# Altium project Project-C-V4.PrjPCB (part 2 of 3)

## Sheet VoltageAmplifier.SchDoc
size B
Used 160 times, as channels U_TOP_VOLTAGE/VOLT1, U_TOP_VOLTAGE/VOLT2, U_TOP_VOLTAGE/VOLT3, U_TOP_VOLTAGE/VOLT4, U_TOP_VOLTAGE/VOLT5, U_TOP_VOLTAGE/VOLT6, U_TOP_VOLTAGE/VOLT7, U_TOP_VOLTAGE/VOLT8, U_TOP_VOLTAGE/VOLT9, U_TOP_VOLTAGE/VOLT10, U_TOP_VOLTAGE/VOLT11, U_TOP_VOLTAGE/VOLT12, U_TOP_VOLTAGE/VOLT13, U_TOP_VOLTAGE/VOLT14, U_TOP_VOLTAGE/VOLT15, U_TOP_VOLTAGE/VOLT16, U_TOP_VOLTAGE/VOLT17, U_TOP_VOLTAGE/VOLT18, U_TOP_VOLTAGE/VOLT19, U_TOP_VOLTAGE/VOLT20, U_TOP_VOLTAGE/VOLT21, U_TOP_VOLTAGE/VOLT22, U_TOP_VOLTAGE/VOLT23, U_TOP_VOLTAGE/VOLT24, U_TOP_VOLTAGE/VOLT25, U_TOP_VOLTAGE/VOLT26, U_TOP_VOLTAGE/VOLT27, U_TOP_VOLTAGE/VOLT28, U_TOP_VOLTAGE/VOLT29, U_TOP_VOLTAGE/VOLT30, U_TOP_VOLTAGE/VOLT31, U_TOP_VOLTAGE/VOLT32, U_TOP_VOLTAGE/VOLT33, U_TOP_VOLTAGE/VOLT34, U_TOP_VOLTAGE/VOLT35, U_TOP_VOLTAGE/VOLT36, U_TOP_VOLTAGE/VOLT37, U_TOP_VOLTAGE/VOLT38, U_TOP_VOLTAGE/VOLT39, U_TOP_VOLTAGE/VOLT40, U_TOP_VOLTAGE/VOLT41, U_TOP_VOLTAGE/VOLT42, U_TOP_VOLTAGE/VOLT43, U_TOP_VOLTAGE/VOLT44, U_TOP_VOLTAGE/VOLT45, U_TOP_VOLTAGE/VOLT46, U_TOP_VOLTAGE/VOLT47, U_TOP_VOLTAGE/VOLT48, U_TOP_VOLTAGE/VOLT49, U_TOP_VOLTAGE/VOLT50, U_TOP_VOLTAGE/VOLT51, U_TOP_VOLTAGE/VOLT52, U_TOP_VOLTAGE/VOLT53, U_TOP_VOLTAGE/VOLT54, U_TOP_VOLTAGE/VOLT55, U_TOP_VOLTAGE/VOLT56, U_TOP_VOLTAGE/VOLT57, U_TOP_VOLTAGE/VOLT58, U_TOP_VOLTAGE/VOLT59, U_TOP_VOLTAGE/VOLT60, U_TOP_VOLTAGE/VOLT61, U_TOP_VOLTAGE/VOLT62, U_TOP_VOLTAGE/VOLT63, U_TOP_VOLTAGE/VOLT64, U_TOP_VOLTAGE/VOLT65, U_TOP_VOLTAGE/VOLT66, U_TOP_VOLTAGE/VOLT67, U_TOP_VOLTAGE/VOLT68, U_TOP_VOLTAGE/VOLT69, U_TOP_VOLTAGE/VOLT70, U_TOP_VOLTAGE/VOLT71, U_TOP_VOLTAGE/VOLT72, U_TOP_VOLTAGE/VOLT73, U_TOP_VOLTAGE/VOLT74, U_TOP_VOLTAGE/VOLT75, U_TOP_VOLTAGE/VOLT76, U_TOP_VOLTAGE/VOLT77, U_TOP_VOLTAGE/VOLT78, U_TOP_VOLTAGE/VOLT79, U_TOP_VOLTAGE/VOLT80, U_TOP_VOLTAGE/VOLT81, U_TOP_VOLTAGE/VOLT82, U_TOP_VOLTAGE/VOLT83, U_TOP_VOLTAGE/VOLT84, U_TOP_VOLTAGE/VOLT85, U_TOP_VOLTAGE/VOLT86, U_TOP_VOLTAGE/VOLT87, U_TOP_VOLTAGE/VOLT88, U_TOP_VOLTAGE/VOLT89, U_TOP_VOLTAGE/VOLT90, U_TOP_VOLTAGE/VOLT91, U_TOP_VOLTAGE/VOLT92, U_TOP_VOLTAGE/VOLT93, U_TOP_VOLTAGE/VOLT94, U_TOP_VOLTAGE/VOLT95, U_TOP_VOLTAGE/VOLT96, U_TOP_VOLTAGE/VOLT97, U_TOP_VOLTAGE/VOLT98, U_TOP_VOLTAGE/VOLT99, U_TOP_VOLTAGE/VOLT100, U_TOP_VOLTAGE/VOLT101, U_TOP_VOLTAGE/VOLT102, U_TOP_VOLTAGE/VOLT103, U_TOP_VOLTAGE/VOLT104, U_TOP_VOLTAGE/VOLT105, U_TOP_VOLTAGE/VOLT106, U_TOP_VOLTAGE/VOLT107, U_TOP_VOLTAGE/VOLT108, U_TOP_VOLTAGE/VOLT109, U_TOP_VOLTAGE/VOLT110, U_TOP_VOLTAGE/VOLT111, U_TOP_VOLTAGE/VOLT112, U_TOP_VOLTAGE/VOLT113, U_TOP_VOLTAGE/VOLT114, U_TOP_VOLTAGE/VOLT115, U_TOP_VOLTAGE/VOLT116, U_TOP_VOLTAGE/VOLT117, U_TOP_VOLTAGE/VOLT118, U_TOP_VOLTAGE/VOLT119, U_TOP_VOLTAGE/VOLT120, U_TOP_VOLTAGE/VOLT121, U_TOP_VOLTAGE/VOLT122, U_TOP_VOLTAGE/VOLT123, U_TOP_VOLTAGE/VOLT124, U_TOP_VOLTAGE/VOLT125, U_TOP_VOLTAGE/VOLT126, U_TOP_VOLTAGE/VOLT127, U_TOP_VOLTAGE/VOLT128, U_TOP_VOLTAGE/VOLT129, U_TOP_VOLTAGE/VOLT130, U_TOP_VOLTAGE/VOLT131, U_TOP_VOLTAGE/VOLT132, U_TOP_VOLTAGE/VOLT133, U_TOP_VOLTAGE/VOLT134, U_TOP_VOLTAGE/VOLT135, U_TOP_VOLTAGE/VOLT136, U_TOP_VOLTAGE/VOLT137, U_TOP_VOLTAGE/VOLT138, U_TOP_VOLTAGE/VOLT139, U_TOP_VOLTAGE/VOLT140, U_TOP_VOLTAGE/VOLT141, U_TOP_VOLTAGE/VOLT142, U_TOP_VOLTAGE/VOLT143, U_TOP_VOLTAGE/VOLT144, U_TOP_VOLTAGE/VOLT145, U_TOP_VOLTAGE/VOLT146, U_TOP_VOLTAGE/VOLT147, U_TOP_VOLTAGE/VOLT148, U_TOP_VOLTAGE/VOLT149, U_TOP_VOLTAGE/VOLT150, U_TOP_VOLTAGE/VOLT151, U_TOP_VOLTAGE/VOLT152, U_TOP_VOLTAGE/VOLT153, U_TOP_VOLTAGE/VOLT154, U_TOP_VOLTAGE/VOLT155, U_TOP_VOLTAGE/VOLT156, U_TOP_VOLTAGE/VOLT157, U_TOP_VOLTAGE/VOLT158, U_TOP_VOLTAGE/VOLT159, U_TOP_VOLTAGE/VOLT160. Parts and nets are listed once, with the designators drawn on the sheet.
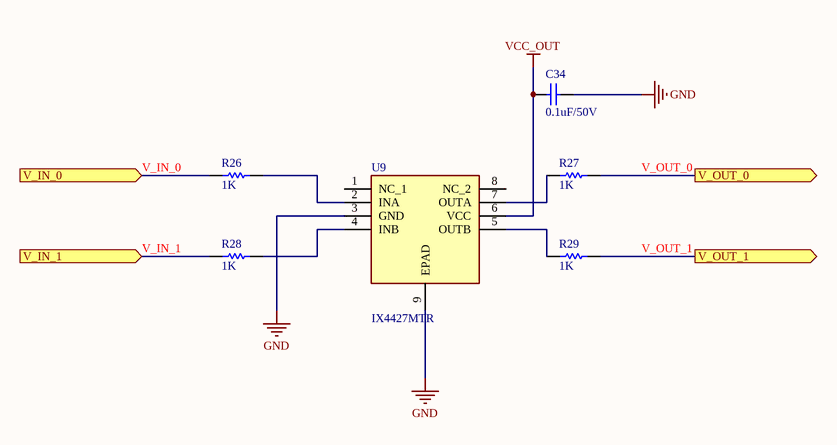
[diagram p5: VoltageAmplifier.SchDoc]

### Parts
C34  0.1uF/50V  [RAD-0.3]
R26  1K  [AXIAL-0.3]
R27  1K  [AXIAL-0.3]
R28  1K  [AXIAL-0.3]
R29  1K  [AXIAL-0.3]
U9  IX4427MTR  [SON65P300X300X90-9N]

### Ports
V_IN_0 (in), V_IN_1 (in), V_OUT_0 (out), V_OUT_1 (out)

### Nets
GND: C34.2 U9.3(GND) U9.9(EPAD)
VCC_OUT: C34.1 U9.6(VCC)
V_IN_0: R26.1 ; port V_IN_0
V_IN_1: R28.1 ; port V_IN_1
V_OUT_0: R27.2 ; port V_OUT_0
V_OUT_1: R29.2 ; port V_OUT_1
NetR26_2: R26.2 U9.2(INA)
NetR27_1: R27.1 U9.7(OUTA)
NetR28_2: R28.2 U9.4(INB)
NetR29_1: R29.1 U9.5(OUTB)

Not connected (* = marked no-connect by the designer): U9 1(NC_1) 8(NC_2)

### Channels
U_TOP_VOLTAGE/VOLT1: designators end in _VOLT1; ports V_IN_0=V_IN_0_VOLT1 V_IN_1=V_IN_1_VOLT1 V_OUT_0=V_OUT_0_VOLT1 V_OUT_1=V_OUT_1_VOLT1
U_TOP_VOLTAGE/VOLT2: designators end in _VOLT2; ports V_IN_0=V_IN_0_VOLT2 V_IN_1=V_IN_1_VOLT2 V_OUT_0=V_OUT_0_VOLT2 V_OUT_1=V_OUT_1_VOLT2
U_TOP_VOLTAGE/VOLT3: designators end in _VOLT3; ports V_IN_0=V_IN_0_VOLT3 V_IN_1=V_IN_1_VOLT3 V_OUT_0=V_OUT_0_VOLT3 V_OUT_1=V_OUT_1_VOLT3
U_TOP_VOLTAGE/VOLT4: designators end in _VOLT4; ports V_IN_0=V_IN_0_VOLT4 V_IN_1=V_IN_1_VOLT4 V_OUT_0=V_OUT_0_VOLT4 V_OUT_1=V_OUT_1_VOLT4
U_TOP_VOLTAGE/VOLT5: designators end in _VOLT5; ports V_IN_0=V_IN_0_VOLT5 V_IN_1=V_IN_1_VOLT5 V_OUT_0=V_OUT_0_VOLT5 V_OUT_1=V_OUT_1_VOLT5
U_TOP_VOLTAGE/VOLT6: designators end in _VOLT6; ports V_IN_0=V_IN_0_VOLT6 V_IN_1=V_IN_1_VOLT6 V_OUT_0=V_OUT_0_VOLT6 V_OUT_1=V_OUT_1_VOLT6
U_TOP_VOLTAGE/VOLT7: designators end in _VOLT7; ports V_IN_0=V_IN_0_VOLT7 V_IN_1=V_IN_1_VOLT7 V_OUT_0=V_OUT_0_VOLT7 V_OUT_1=V_OUT_1_VOLT7
U_TOP_VOLTAGE/VOLT8: designators end in _VOLT8; ports V_IN_0=V_IN_0_VOLT8 V_IN_1=V_IN_1_VOLT8 V_OUT_0=V_OUT_0_VOLT8 V_OUT_1=V_OUT_1_VOLT8
U_TOP_VOLTAGE/VOLT9: designators end in _VOLT9; ports V_IN_0=V_IN_0_VOLT9 V_IN_1=V_IN_1_VOLT9 V_OUT_0=V_OUT_0_VOLT9 V_OUT_1=V_OUT_1_VOLT9
U_TOP_VOLTAGE/VOLT10: designators end in _VOLT10; ports V_IN_0=V_IN_0_VOLT10 V_IN_1=V_IN_1_VOLT10 V_OUT_0=V_OUT_0_VOLT10 V_OUT_1=V_OUT_1_VOLT10
U_TOP_VOLTAGE/VOLT11: designators end in _VOLT11; ports V_IN_0=V_IN_0_VOLT11 V_IN_1=V_IN_1_VOLT11 V_OUT_0=V_OUT_0_VOLT11 V_OUT_1=V_OUT_1_VOLT11
U_TOP_VOLTAGE/VOLT12: designators end in _VOLT12; ports V_IN_0=V_IN_0_VOLT12 V_IN_1=V_IN_1_VOLT12 V_OUT_0=V_OUT_0_VOLT12 V_OUT_1=V_OUT_1_VOLT12
U_TOP_VOLTAGE/VOLT13: designators end in _VOLT13; ports V_IN_0=V_IN_0_VOLT13 V_IN_1=V_IN_1_VOLT13 V_OUT_0=V_OUT_0_VOLT13 V_OUT_1=V_OUT_1_VOLT13
U_TOP_VOLTAGE/VOLT14: designators end in _VOLT14; ports V_IN_0=V_IN_0_VOLT14 V_IN_1=V_IN_1_VOLT14 V_OUT_0=V_OUT_0_VOLT14 V_OUT_1=V_OUT_1_VOLT14
U_TOP_VOLTAGE/VOLT15: designators end in _VOLT15; ports V_IN_0=V_IN_0_VOLT15 V_IN_1=V_IN_1_VOLT15 V_OUT_0=V_OUT_0_VOLT15 V_OUT_1=V_OUT_1_VOLT15
U_TOP_VOLTAGE/VOLT16: designators end in _VOLT16; ports V_IN_0=V_IN_0_VOLT16 V_IN_1=V_IN_1_VOLT16 V_OUT_0=V_OUT_0_VOLT16 V_OUT_1=V_OUT_1_VOLT16
U_TOP_VOLTAGE/VOLT17: designators end in _VOLT17; ports V_IN_0=V_IN_0_VOLT17 V_IN_1=V_IN_1_VOLT17 V_OUT_0=V_OUT_0_VOLT17 V_OUT_1=V_OUT_1_VOLT17
U_TOP_VOLTAGE/VOLT18: designators end in _VOLT18; ports V_IN_0=V_IN_0_VOLT18 V_IN_1=V_IN_1_VOLT18 V_OUT_0=V_OUT_0_VOLT18 V_OUT_1=V_OUT_1_VOLT18
U_TOP_VOLTAGE/VOLT19: designators end in _VOLT19; ports V_IN_0=V_IN_0_VOLT19 V_IN_1=V_IN_1_VOLT19 V_OUT_0=V_OUT_0_VOLT19 V_OUT_1=V_OUT_1_VOLT19
U_TOP_VOLTAGE/VOLT20: designators end in _VOLT20; ports V_IN_0=V_IN_0_VOLT20 V_IN_1=V_IN_1_VOLT20 V_OUT_0=V_OUT_0_VOLT20 V_OUT_1=V_OUT_1_VOLT20
U_TOP_VOLTAGE/VOLT21: designators end in _VOLT21; ports V_IN_0=V_IN_0_VOLT21 V_IN_1=V_IN_1_VOLT21 V_OUT_0=V_OUT_0_VOLT21 V_OUT_1=V_OUT_1_VOLT21
U_TOP_VOLTAGE/VOLT22: designators end in _VOLT22; ports V_IN_0=V_IN_0_VOLT22 V_IN_1=V_IN_1_VOLT22 V_OUT_0=V_OUT_0_VOLT22 V_OUT_1=V_OUT_1_VOLT22
U_TOP_VOLTAGE/VOLT23: designators end in _VOLT23; ports V_IN_0=V_IN_0_VOLT23 V_IN_1=V_IN_1_VOLT23 V_OUT_0=V_OUT_0_VOLT23 V_OUT_1=V_OUT_1_VOLT23
U_TOP_VOLTAGE/VOLT24: designators end in _VOLT24; ports V_IN_0=V_IN_0_VOLT24 V_IN_1=V_IN_1_VOLT24 V_OUT_0=V_OUT_0_VOLT24 V_OUT_1=V_OUT_1_VOLT24
U_TOP_VOLTAGE/VOLT25: designators end in _VOLT25; ports V_IN_0=V_IN_0_VOLT25 V_IN_1=V_IN_1_VOLT25 V_OUT_0=V_OUT_0_VOLT25 V_OUT_1=V_OUT_1_VOLT25
U_TOP_VOLTAGE/VOLT26: designators end in _VOLT26; ports V_IN_0=V_IN_0_VOLT26 V_IN_1=V_IN_1_VOLT26 V_OUT_0=V_OUT_0_VOLT26 V_OUT_1=V_OUT_1_VOLT26
U_TOP_VOLTAGE/VOLT27: designators end in _VOLT27; ports V_IN_0=V_IN_0_VOLT27 V_IN_1=V_IN_1_VOLT27 V_OUT_0=V_OUT_0_VOLT27 V_OUT_1=V_OUT_1_VOLT27
U_TOP_VOLTAGE/VOLT28: designators end in _VOLT28; ports V_IN_0=V_IN_0_VOLT28 V_IN_1=V_IN_1_VOLT28 V_OUT_0=V_OUT_0_VOLT28 V_OUT_1=V_OUT_1_VOLT28
U_TOP_VOLTAGE/VOLT29: designators end in _VOLT29; ports V_IN_0=V_IN_0_VOLT29 V_IN_1=V_IN_1_VOLT29 V_OUT_0=V_OUT_0_VOLT29 V_OUT_1=V_OUT_1_VOLT29
U_TOP_VOLTAGE/VOLT30: designators end in _VOLT30; ports V_IN_0=V_IN_0_VOLT30 V_IN_1=V_IN_1_VOLT30 V_OUT_0=V_OUT_0_VOLT30 V_OUT_1=V_OUT_1_VOLT30
U_TOP_VOLTAGE/VOLT31: designators end in _VOLT31; ports V_IN_0=V_IN_0_VOLT31 V_IN_1=V_IN_1_VOLT31 V_OUT_0=V_OUT_0_VOLT31 V_OUT_1=V_OUT_1_VOLT31
U_TOP_VOLTAGE/VOLT32: designators end in _VOLT32; ports V_IN_0=V_IN_0_VOLT32 V_IN_1=V_IN_1_VOLT32 V_OUT_0=V_OUT_0_VOLT32 V_OUT_1=V_OUT_1_VOLT32
U_TOP_VOLTAGE/VOLT33: designators end in _VOLT33; ports V_IN_0=V_IN_0_VOLT33 V_IN_1=V_IN_1_VOLT33 V_OUT_0=V_OUT_0_VOLT33 V_OUT_1=V_OUT_1_VOLT33
U_TOP_VOLTAGE/VOLT34: designators end in _VOLT34; ports V_IN_0=V_IN_0_VOLT34 V_IN_1=V_IN_1_VOLT34 V_OUT_0=V_OUT_0_VOLT34 V_OUT_1=V_OUT_1_VOLT34
U_TOP_VOLTAGE/VOLT35: designators end in _VOLT35; ports V_IN_0=V_IN_0_VOLT35 V_IN_1=V_IN_1_VOLT35 V_OUT_0=V_OUT_0_VOLT35 V_OUT_1=V_OUT_1_VOLT35
U_TOP_VOLTAGE/VOLT36: designators end in _VOLT36; ports V_IN_0=V_IN_0_VOLT36 V_IN_1=V_IN_1_VOLT36 V_OUT_0=V_OUT_0_VOLT36 V_OUT_1=V_OUT_1_VOLT36
U_TOP_VOLTAGE/VOLT37: designators end in _VOLT37; ports V_IN_0=V_IN_0_VOLT37 V_IN_1=V_IN_1_VOLT37 V_OUT_0=V_OUT_0_VOLT37 V_OUT_1=V_OUT_1_VOLT37
U_TOP_VOLTAGE/VOLT38: designators end in _VOLT38; ports V_IN_0=V_IN_0_VOLT38 V_IN_1=V_IN_1_VOLT38 V_OUT_0=V_OUT_0_VOLT38 V_OUT_1=V_OUT_1_VOLT38
U_TOP_VOLTAGE/VOLT39: designators end in _VOLT39; ports V_IN_0=V_IN_0_VOLT39 V_IN_1=V_IN_1_VOLT39 V_OUT_0=V_OUT_0_VOLT39 V_OUT_1=V_OUT_1_VOLT39
U_TOP_VOLTAGE/VOLT40: designators end in _VOLT40; ports V_IN_0=V_IN_0_VOLT40 V_IN_1=V_IN_1_VOLT40 V_OUT_0=V_OUT_0_VOLT40 V_OUT_1=V_OUT_1_VOLT40
U_TOP_VOLTAGE/VOLT41: designators end in _VOLT41; ports V_IN_0=V_IN_0_VOLT41 V_IN_1=V_IN_1_VOLT41 V_OUT_0=V_OUT_0_VOLT41 V_OUT_1=V_OUT_1_VOLT41
U_TOP_VOLTAGE/VOLT42: designators end in _VOLT42; ports V_IN_0=V_IN_0_VOLT42 V_IN_1=V_IN_1_VOLT42 V_OUT_0=V_OUT_0_VOLT42 V_OUT_1=V_OUT_1_VOLT42
U_TOP_VOLTAGE/VOLT43: designators end in _VOLT43; ports V_IN_0=V_IN_0_VOLT43 V_IN_1=V_IN_1_VOLT43 V_OUT_0=V_OUT_0_VOLT43 V_OUT_1=V_OUT_1_VOLT43
U_TOP_VOLTAGE/VOLT44: designators end in _VOLT44; ports V_IN_0=V_IN_0_VOLT44 V_IN_1=V_IN_1_VOLT44 V_OUT_0=V_OUT_0_VOLT44 V_OUT_1=V_OUT_1_VOLT44
U_TOP_VOLTAGE/VOLT45: designators end in _VOLT45; ports V_IN_0=V_IN_0_VOLT45 V_IN_1=V_IN_1_VOLT45 V_OUT_0=V_OUT_0_VOLT45 V_OUT_1=V_OUT_1_VOLT45
U_TOP_VOLTAGE/VOLT46: designators end in _VOLT46; ports V_IN_0=V_IN_0_VOLT46 V_IN_1=V_IN_1_VOLT46 V_OUT_0=V_OUT_0_VOLT46 V_OUT_1=V_OUT_1_VOLT46
U_TOP_VOLTAGE/VOLT47: designators end in _VOLT47; ports V_IN_0=V_IN_0_VOLT47 V_IN_1=V_IN_1_VOLT47 V_OUT_0=V_OUT_0_VOLT47 V_OUT_1=V_OUT_1_VOLT47
U_TOP_VOLTAGE/VOLT48: designators end in _VOLT48; ports V_IN_0=V_IN_0_VOLT48 V_IN_1=V_IN_1_VOLT48 V_OUT_0=V_OUT_0_VOLT48 V_OUT_1=V_OUT_1_VOLT48
U_TOP_VOLTAGE/VOLT49: designators end in _VOLT49; ports V_IN_0=V_IN_0_VOLT49 V_IN_1=V_IN_1_VOLT49 V_OUT_0=V_OUT_0_VOLT49 V_OUT_1=V_OUT_1_VOLT49
U_TOP_VOLTAGE/VOLT50: designators end in _VOLT50; ports V_IN_0=V_IN_0_VOLT50 V_IN_1=V_IN_1_VOLT50 V_OUT_0=V_OUT_0_VOLT50 V_OUT_1=V_OUT_1_VOLT50
U_TOP_VOLTAGE/VOLT51: designators end in _VOLT51; ports V_IN_0=V_IN_0_VOLT51 V_IN_1=V_IN_1_VOLT51 V_OUT_0=V_OUT_0_VOLT51 V_OUT_1=V_OUT_1_VOLT51
U_TOP_VOLTAGE/VOLT52: designators end in _VOLT52; ports V_IN_0=V_IN_0_VOLT52 V_IN_1=V_IN_1_VOLT52 V_OUT_0=V_OUT_0_VOLT52 V_OUT_1=V_OUT_1_VOLT52
U_TOP_VOLTAGE/VOLT53: designators end in _VOLT53; ports V_IN_0=V_IN_0_VOLT53 V_IN_1=V_IN_1_VOLT53 V_OUT_0=V_OUT_0_VOLT53 V_OUT_1=V_OUT_1_VOLT53
U_TOP_VOLTAGE/VOLT54: designators end in _VOLT54; ports V_IN_0=V_IN_0_VOLT54 V_IN_1=V_IN_1_VOLT54 V_OUT_0=V_OUT_0_VOLT54 V_OUT_1=V_OUT_1_VOLT54
U_TOP_VOLTAGE/VOLT55: designators end in _VOLT55; ports V_IN_0=V_IN_0_VOLT55 V_IN_1=V_IN_1_VOLT55 V_OUT_0=V_OUT_0_VOLT55 V_OUT_1=V_OUT_1_VOLT55
U_TOP_VOLTAGE/VOLT56: designators end in _VOLT56; ports V_IN_0=V_IN_0_VOLT56 V_IN_1=V_IN_1_VOLT56 V_OUT_0=V_OUT_0_VOLT56 V_OUT_1=V_OUT_1_VOLT56
U_TOP_VOLTAGE/VOLT57: designators end in _VOLT57; ports V_IN_0=V_IN_0_VOLT57 V_IN_1=V_IN_1_VOLT57 V_OUT_0=V_OUT_0_VOLT57 V_OUT_1=V_OUT_1_VOLT57
U_TOP_VOLTAGE/VOLT58: designators end in _VOLT58; ports V_IN_0=V_IN_0_VOLT58 V_IN_1=V_IN_1_VOLT58 V_OUT_0=V_OUT_0_VOLT58 V_OUT_1=V_OUT_1_VOLT58
U_TOP_VOLTAGE/VOLT59: designators end in _VOLT59; ports V_IN_0=V_IN_0_VOLT59 V_IN_1=V_IN_1_VOLT59 V_OUT_0=V_OUT_0_VOLT59 V_OUT_1=V_OUT_1_VOLT59
U_TOP_VOLTAGE/VOLT60: designators end in _VOLT60; ports V_IN_0=V_IN_0_VOLT60 V_IN_1=V_IN_1_VOLT60 V_OUT_0=V_OUT_0_VOLT60 V_OUT_1=V_OUT_1_VOLT60
U_TOP_VOLTAGE/VOLT61: designators end in _VOLT61; ports V_IN_0=V_IN_0_VOLT61 V_IN_1=V_IN_1_VOLT61 V_OUT_0=V_OUT_0_VOLT61 V_OUT_1=V_OUT_1_VOLT61
U_TOP_VOLTAGE/VOLT62: designators end in _VOLT62; ports V_IN_0=V_IN_0_VOLT62 V_IN_1=V_IN_1_VOLT62 V_OUT_0=V_OUT_0_VOLT62 V_OUT_1=V_OUT_1_VOLT62
U_TOP_VOLTAGE/VOLT63: designators end in _VOLT63; ports V_IN_0=V_IN_0_VOLT63 V_IN_1=V_IN_1_VOLT63 V_OUT_0=V_OUT_0_VOLT63 V_OUT_1=V_OUT_1_VOLT63
U_TOP_VOLTAGE/VOLT64: designators end in _VOLT64; ports V_IN_0=V_IN_0_VOLT64 V_IN_1=V_IN_1_VOLT64 V_OUT_0=V_OUT_0_VOLT64 V_OUT_1=V_OUT_1_VOLT64
U_TOP_VOLTAGE/VOLT65: designators end in _VOLT65; ports V_IN_0=V_IN_0_VOLT65 V_IN_1=V_IN_1_VOLT65 V_OUT_0=V_OUT_0_VOLT65 V_OUT_1=V_OUT_1_VOLT65
U_TOP_VOLTAGE/VOLT66: designators end in _VOLT66; ports V_IN_0=V_IN_0_VOLT66 V_IN_1=V_IN_1_VOLT66 V_OUT_0=V_OUT_0_VOLT66 V_OUT_1=V_OUT_1_VOLT66
U_TOP_VOLTAGE/VOLT67: designators end in _VOLT67; ports V_IN_0=V_IN_0_VOLT67 V_IN_1=V_IN_1_VOLT67 V_OUT_0=V_OUT_0_VOLT67 V_OUT_1=V_OUT_1_VOLT67
U_TOP_VOLTAGE/VOLT68: designators end in _VOLT68; ports V_IN_0=V_IN_0_VOLT68 V_IN_1=V_IN_1_VOLT68 V_OUT_0=V_OUT_0_VOLT68 V_OUT_1=V_OUT_1_VOLT68
U_TOP_VOLTAGE/VOLT69: designators end in _VOLT69; ports V_IN_0=V_IN_0_VOLT69 V_IN_1=V_IN_1_VOLT69 V_OUT_0=V_OUT_0_VOLT69 V_OUT_1=V_OUT_1_VOLT69
U_TOP_VOLTAGE/VOLT70: designators end in _VOLT70; ports V_IN_0=V_IN_0_VOLT70 V_IN_1=V_IN_1_VOLT70 V_OUT_0=V_OUT_0_VOLT70 V_OUT_1=V_OUT_1_VOLT70
U_TOP_VOLTAGE/VOLT71: designators end in _VOLT71; ports V_IN_0=V_IN_0_VOLT71 V_IN_1=V_IN_1_VOLT71 V_OUT_0=V_OUT_0_VOLT71 V_OUT_1=V_OUT_1_VOLT71
U_TOP_VOLTAGE/VOLT72: designators end in _VOLT72; ports V_IN_0=V_IN_0_VOLT72 V_IN_1=V_IN_1_VOLT72 V_OUT_0=V_OUT_0_VOLT72 V_OUT_1=V_OUT_1_VOLT72
U_TOP_VOLTAGE/VOLT73: designators end in _VOLT73; ports V_IN_0=V_IN_0_VOLT73 V_IN_1=V_IN_1_VOLT73 V_OUT_0=V_OUT_0_VOLT73 V_OUT_1=V_OUT_1_VOLT73
U_TOP_VOLTAGE/VOLT74: designators end in _VOLT74; ports V_IN_0=V_IN_0_VOLT74 V_IN_1=V_IN_1_VOLT74 V_OUT_0=V_OUT_0_VOLT74 V_OUT_1=V_OUT_1_VOLT74
U_TOP_VOLTAGE/VOLT75: designators end in _VOLT75; ports V_IN_0=V_IN_0_VOLT75 V_IN_1=V_IN_1_VOLT75 V_OUT_0=V_OUT_0_VOLT75 V_OUT_1=V_OUT_1_VOLT75
U_TOP_VOLTAGE/VOLT76: designators end in _VOLT76; ports V_IN_0=V_IN_0_VOLT76 V_IN_1=V_IN_1_VOLT76 V_OUT_0=V_OUT_0_VOLT76 V_OUT_1=V_OUT_1_VOLT76
U_TOP_VOLTAGE/VOLT77: designators end in _VOLT77; ports V_IN_0=V_IN_0_VOLT77 V_IN_1=V_IN_1_VOLT77 V_OUT_0=V_OUT_0_VOLT77 V_OUT_1=V_OUT_1_VOLT77
U_TOP_VOLTAGE/VOLT78: designators end in _VOLT78; ports V_IN_0=V_IN_0_VOLT78 V_IN_1=V_IN_1_VOLT78 V_OUT_0=V_OUT_0_VOLT78 V_OUT_1=V_OUT_1_VOLT78
U_TOP_VOLTAGE/VOLT79: designators end in _VOLT79; ports V_IN_0=V_IN_0_VOLT79 V_IN_1=V_IN_1_VOLT79 V_OUT_0=V_OUT_0_VOLT79 V_OUT_1=V_OUT_1_VOLT79
U_TOP_VOLTAGE/VOLT80: designators end in _VOLT80; ports V_IN_0=V_IN_0_VOLT80 V_IN_1=V_IN_1_VOLT80 V_OUT_0=V_OUT_0_VOLT80 V_OUT_1=V_OUT_1_VOLT80
U_TOP_VOLTAGE/VOLT81: designators end in _VOLT81; ports V_IN_0=V_IN_0_VOLT81 V_IN_1=V_IN_1_VOLT81 V_OUT_0=V_OUT_0_VOLT81 V_OUT_1=V_OUT_1_VOLT81
U_TOP_VOLTAGE/VOLT82: designators end in _VOLT82; ports V_IN_0=V_IN_0_VOLT82 V_IN_1=V_IN_1_VOLT82 V_OUT_0=V_OUT_0_VOLT82 V_OUT_1=V_OUT_1_VOLT82
U_TOP_VOLTAGE/VOLT83: designators end in _VOLT83; ports V_IN_0=V_IN_0_VOLT83 V_IN_1=V_IN_1_VOLT83 V_OUT_0=V_OUT_0_VOLT83 V_OUT_1=V_OUT_1_VOLT83
U_TOP_VOLTAGE/VOLT84: designators end in _VOLT84; ports V_IN_0=V_IN_0_VOLT84 V_IN_1=V_IN_1_VOLT84 V_OUT_0=V_OUT_0_VOLT84 V_OUT_1=V_OUT_1_VOLT84
U_TOP_VOLTAGE/VOLT85: designators end in _VOLT85; ports V_IN_0=V_IN_0_VOLT85 V_IN_1=V_IN_1_VOLT85 V_OUT_0=V_OUT_0_VOLT85 V_OUT_1=V_OUT_1_VOLT85
U_TOP_VOLTAGE/VOLT86: designators end in _VOLT86; ports V_IN_0=V_IN_0_VOLT86 V_IN_1=V_IN_1_VOLT86 V_OUT_0=V_OUT_0_VOLT86 V_OUT_1=V_OUT_1_VOLT86
U_TOP_VOLTAGE/VOLT87: designators end in _VOLT87; ports V_IN_0=V_IN_0_VOLT87 V_IN_1=V_IN_1_VOLT87 V_OUT_0=V_OUT_0_VOLT87 V_OUT_1=V_OUT_1_VOLT87
U_TOP_VOLTAGE/VOLT88: designators end in _VOLT88; ports V_IN_0=V_IN_0_VOLT88 V_IN_1=V_IN_1_VOLT88 V_OUT_0=V_OUT_0_VOLT88 V_OUT_1=V_OUT_1_VOLT88
U_TOP_VOLTAGE/VOLT89: designators end in _VOLT89; ports V_IN_0=V_IN_0_VOLT89 V_IN_1=V_IN_1_VOLT89 V_OUT_0=V_OUT_0_VOLT89 V_OUT_1=V_OUT_1_VOLT89
U_TOP_VOLTAGE/VOLT90: designators end in _VOLT90; ports V_IN_0=V_IN_0_VOLT90 V_IN_1=V_IN_1_VOLT90 V_OUT_0=V_OUT_0_VOLT90 V_OUT_1=V_OUT_1_VOLT90
U_TOP_VOLTAGE/VOLT91: designators end in _VOLT91; ports V_IN_0=V_IN_0_VOLT91 V_IN_1=V_IN_1_VOLT91 V_OUT_0=V_OUT_0_VOLT91 V_OUT_1=V_OUT_1_VOLT91
U_TOP_VOLTAGE/VOLT92: designators end in _VOLT92; ports V_IN_0=V_IN_0_VOLT92 V_IN_1=V_IN_1_VOLT92 V_OUT_0=V_OUT_0_VOLT92 V_OUT_1=V_OUT_1_VOLT92
U_TOP_VOLTAGE/VOLT93: designators end in _VOLT93; ports V_IN_0=V_IN_0_VOLT93 V_IN_1=V_IN_1_VOLT93 V_OUT_0=V_OUT_0_VOLT93 V_OUT_1=V_OUT_1_VOLT93
U_TOP_VOLTAGE/VOLT94: designators end in _VOLT94; ports V_IN_0=V_IN_0_VOLT94 V_IN_1=V_IN_1_VOLT94 V_OUT_0=V_OUT_0_VOLT94 V_OUT_1=V_OUT_1_VOLT94
U_TOP_VOLTAGE/VOLT95: designators end in _VOLT95; ports V_IN_0=V_IN_0_VOLT95 V_IN_1=V_IN_1_VOLT95 V_OUT_0=V_OUT_0_VOLT95 V_OUT_1=V_OUT_1_VOLT95
U_TOP_VOLTAGE/VOLT96: designators end in _VOLT96; ports V_IN_0=V_IN_0_VOLT96 V_IN_1=V_IN_1_VOLT96 V_OUT_0=V_OUT_0_VOLT96 V_OUT_1=V_OUT_1_VOLT96
U_TOP_VOLTAGE/VOLT97: designators end in _VOLT97; ports V_IN_0=V_IN_0_VOLT97 V_IN_1=V_IN_1_VOLT97 V_OUT_0=V_OUT_0_VOLT97 V_OUT_1=V_OUT_1_VOLT97
U_TOP_VOLTAGE/VOLT98: designators end in _VOLT98; ports V_IN_0=V_IN_0_VOLT98 V_IN_1=V_IN_1_VOLT98 V_OUT_0=V_OUT_0_VOLT98 V_OUT_1=V_OUT_1_VOLT98
U_TOP_VOLTAGE/VOLT99: designators end in _VOLT99; ports V_IN_0=V_IN_0_VOLT99 V_IN_1=V_IN_1_VOLT99 V_OUT_0=V_OUT_0_VOLT99 V_OUT_1=V_OUT_1_VOLT99
U_TOP_VOLTAGE/VOLT100: designators end in _VOLT100; ports V_IN_0=V_IN_0_VOLT100 V_IN_1=V_IN_1_VOLT100 V_OUT_0=V_OUT_0_VOLT100 V_OUT_1=V_OUT_1_VOLT100
U_TOP_VOLTAGE/VOLT101: designators end in _VOLT101; ports V_IN_0=V_IN_0_VOLT101 V_IN_1=V_IN_1_VOLT101 V_OUT_0=V_OUT_0_VOLT101 V_OUT_1=V_OUT_1_VOLT101
U_TOP_VOLTAGE/VOLT102: designators end in _VOLT102; ports V_IN_0=V_IN_0_VOLT102 V_IN_1=V_IN_1_VOLT102 V_OUT_0=V_OUT_0_VOLT102 V_OUT_1=V_OUT_1_VOLT102
U_TOP_VOLTAGE/VOLT103: designators end in _VOLT103; ports V_IN_0=V_IN_0_VOLT103 V_IN_1=V_IN_1_VOLT103 V_OUT_0=V_OUT_0_VOLT103 V_OUT_1=V_OUT_1_VOLT103
U_TOP_VOLTAGE/VOLT104: designators end in _VOLT104; ports V_IN_0=V_IN_0_VOLT104 V_IN_1=V_IN_1_VOLT104 V_OUT_0=V_OUT_0_VOLT104 V_OUT_1=V_OUT_1_VOLT104
U_TOP_VOLTAGE/VOLT105: designators end in _VOLT105; ports V_IN_0=V_IN_0_VOLT105 V_IN_1=V_IN_1_VOLT105 V_OUT_0=V_OUT_0_VOLT105 V_OUT_1=V_OUT_1_VOLT105
U_TOP_VOLTAGE/VOLT106: designators end in _VOLT106; ports V_IN_0=V_IN_0_VOLT106 V_IN_1=V_IN_1_VOLT106 V_OUT_0=V_OUT_0_VOLT106 V_OUT_1=V_OUT_1_VOLT106
U_TOP_VOLTAGE/VOLT107: designators end in _VOLT107; ports V_IN_0=V_IN_0_VOLT107 V_IN_1=V_IN_1_VOLT107 V_OUT_0=V_OUT_0_VOLT107 V_OUT_1=V_OUT_1_VOLT107
U_TOP_VOLTAGE/VOLT108: designators end in _VOLT108; ports V_IN_0=V_IN_0_VOLT108 V_IN_1=V_IN_1_VOLT108 V_OUT_0=V_OUT_0_VOLT108 V_OUT_1=V_OUT_1_VOLT108
U_TOP_VOLTAGE/VOLT109: designators end in _VOLT109; ports V_IN_0=V_IN_0_VOLT109 V_IN_1=V_IN_1_VOLT109 V_OUT_0=V_OUT_0_VOLT109 V_OUT_1=V_OUT_1_VOLT109
U_TOP_VOLTAGE/VOLT110: designators end in _VOLT110; ports V_IN_0=V_IN_0_VOLT110 V_IN_1=V_IN_1_VOLT110 V_OUT_0=V_OUT_0_VOLT110 V_OUT_1=V_OUT_1_VOLT110
U_TOP_VOLTAGE/VOLT111: designators end in _VOLT111; ports V_IN_0=V_IN_0_VOLT111 V_IN_1=V_IN_1_VOLT111 V_OUT_0=V_OUT_0_VOLT111 V_OUT_1=V_OUT_1_VOLT111
U_TOP_VOLTAGE/VOLT112: designators end in _VOLT112; ports V_IN_0=V_IN_0_VOLT112 V_IN_1=V_IN_1_VOLT112 V_OUT_0=V_OUT_0_VOLT112 V_OUT_1=V_OUT_1_VOLT112
U_TOP_VOLTAGE/VOLT113: designators end in _VOLT113; ports V_IN_0=V_IN_0_VOLT113 V_IN_1=V_IN_1_VOLT113 V_OUT_0=V_OUT_0_VOLT113 V_OUT_1=V_OUT_1_VOLT113
U_TOP_VOLTAGE/VOLT114: designators end in _VOLT114; ports V_IN_0=V_IN_0_VOLT114 V_IN_1=V_IN_1_VOLT114 V_OUT_0=V_OUT_0_VOLT114 V_OUT_1=V_OUT_1_VOLT114
U_TOP_VOLTAGE/VOLT115: designators end in _VOLT115; ports V_IN_0=V_IN_0_VOLT115 V_IN_1=V_IN_1_VOLT115 V_OUT_0=V_OUT_0_VOLT115 V_OUT_1=V_OUT_1_VOLT115
U_TOP_VOLTAGE/VOLT116: designators end in _VOLT116; ports V_IN_0=V_IN_0_VOLT116 V_IN_1=V_IN_1_VOLT116 V_OUT_0=V_OUT_0_VOLT116 V_OUT_1=V_OUT_1_VOLT116
U_TOP_VOLTAGE/VOLT117: designators end in _VOLT117; ports V_IN_0=V_IN_0_VOLT117 V_IN_1=V_IN_1_VOLT117 V_OUT_0=V_OUT_0_VOLT117 V_OUT_1=V_OUT_1_VOLT117
U_TOP_VOLTAGE/VOLT118: designators end in _VOLT118; ports V_IN_0=V_IN_0_VOLT118 V_IN_1=V_IN_1_VOLT118 V_OUT_0=V_OUT_0_VOLT118 V_OUT_1=V_OUT_1_VOLT118
U_TOP_VOLTAGE/VOLT119: designators end in _VOLT119; ports V_IN_0=V_IN_0_VOLT119 V_IN_1=V_IN_1_VOLT119 V_OUT_0=V_OUT_0_VOLT119 V_OUT_1=V_OUT_1_VOLT119
U_TOP_VOLTAGE/VOLT120: designators end in _VOLT120; ports V_IN_0=V_IN_0_VOLT120 V_IN_1=V_IN_1_VOLT120 V_OUT_0=V_OUT_0_VOLT120 V_OUT_1=V_OUT_1_VOLT120
U_TOP_VOLTAGE/VOLT121: designators end in _VOLT121; ports V_IN_0=V_IN_0_VOLT121 V_IN_1=V_IN_1_VOLT121 V_OUT_0=V_OUT_0_VOLT121 V_OUT_1=V_OUT_1_VOLT121
U_TOP_VOLTAGE/VOLT122: designators end in _VOLT122; ports V_IN_0=V_IN_0_VOLT122 V_IN_1=V_IN_1_VOLT122 V_OUT_0=V_OUT_0_VOLT122 V_OUT_1=V_OUT_1_VOLT122
U_TOP_VOLTAGE/VOLT123: designators end in _VOLT123; ports V_IN_0=V_IN_0_VOLT123 V_IN_1=V_IN_1_VOLT123 V_OUT_0=V_OUT_0_VOLT123 V_OUT_1=V_OUT_1_VOLT123
U_TOP_VOLTAGE/VOLT124: designators end in _VOLT124; ports V_IN_0=V_IN_0_VOLT124 V_IN_1=V_IN_1_VOLT124 V_OUT_0=V_OUT_0_VOLT124 V_OUT_1=V_OUT_1_VOLT124
U_TOP_VOLTAGE/VOLT125: designators end in _VOLT125; ports V_IN_0=V_IN_0_VOLT125 V_IN_1=V_IN_1_VOLT125 V_OUT_0=V_OUT_0_VOLT125 V_OUT_1=V_OUT_1_VOLT125
U_TOP_VOLTAGE/VOLT126: designators end in _VOLT126; ports V_IN_0=V_IN_0_VOLT126 V_IN_1=V_IN_1_VOLT126 V_OUT_0=V_OUT_0_VOLT126 V_OUT_1=V_OUT_1_VOLT126
U_TOP_VOLTAGE/VOLT127: designators end in _VOLT127; ports V_IN_0=V_IN_0_VOLT127 V_IN_1=V_IN_1_VOLT127 V_OUT_0=V_OUT_0_VOLT127 V_OUT_1=V_OUT_1_VOLT127
U_TOP_VOLTAGE/VOLT128: designators end in _VOLT128; ports V_IN_0=V_IN_0_VOLT128 V_IN_1=V_IN_1_VOLT128 V_OUT_0=V_OUT_0_VOLT128 V_OUT_1=V_OUT_1_VOLT128
U_TOP_VOLTAGE/VOLT129: designators end in _VOLT129; ports V_IN_0=V_IN_0_VOLT129 V_IN_1=V_IN_1_VOLT129 V_OUT_0=V_OUT_0_VOLT129 V_OUT_1=V_OUT_1_VOLT129
U_TOP_VOLTAGE/VOLT130: designators end in _VOLT130; ports V_IN_0=V_IN_0_VOLT130 V_IN_1=V_IN_1_VOLT130 V_OUT_0=V_OUT_0_VOLT130 V_OUT_1=V_OUT_1_VOLT130
U_TOP_VOLTAGE/VOLT131: designators end in _VOLT131; ports V_IN_0=V_IN_0_VOLT131 V_IN_1=V_IN_1_VOLT131 V_OUT_0=V_OUT_0_VOLT131 V_OUT_1=V_OUT_1_VOLT131
U_TOP_VOLTAGE/VOLT132: designators end in _VOLT132; ports V_IN_0=V_IN_0_VOLT132 V_IN_1=V_IN_1_VOLT132 V_OUT_0=V_OUT_0_VOLT132 V_OUT_1=V_OUT_1_VOLT132
U_TOP_VOLTAGE/VOLT133: designators end in _VOLT133; ports V_IN_0=V_IN_0_VOLT133 V_IN_1=V_IN_1_VOLT133 V_OUT_0=V_OUT_0_VOLT133 V_OUT_1=V_OUT_1_VOLT133
U_TOP_VOLTAGE/VOLT134: designators end in _VOLT134; ports V_IN_0=V_IN_0_VOLT134 V_IN_1=V_IN_1_VOLT134 V_OUT_0=V_OUT_0_VOLT134 V_OUT_1=V_OUT_1_VOLT134
U_TOP_VOLTAGE/VOLT135: designators end in _VOLT135; ports V_IN_0=V_IN_0_VOLT135 V_IN_1=V_IN_1_VOLT135 V_OUT_0=V_OUT_0_VOLT135 V_OUT_1=V_OUT_1_VOLT135
U_TOP_VOLTAGE/VOLT136: designators end in _VOLT136; ports V_IN_0=V_IN_0_VOLT136 V_IN_1=V_IN_1_VOLT136 V_OUT_0=V_OUT_0_VOLT136 V_OUT_1=V_OUT_1_VOLT136
U_TOP_VOLTAGE/VOLT137: designators end in _VOLT137; ports V_IN_0=V_IN_0_VOLT137 V_IN_1=V_IN_1_VOLT137 V_OUT_0=V_OUT_0_VOLT137 V_OUT_1=V_OUT_1_VOLT137
U_TOP_VOLTAGE/VOLT138: designators end in _VOLT138; ports V_IN_0=V_IN_0_VOLT138 V_IN_1=V_IN_1_VOLT138 V_OUT_0=V_OUT_0_VOLT138 V_OUT_1=V_OUT_1_VOLT138
U_TOP_VOLTAGE/VOLT139: designators end in _VOLT139; ports V_IN_0=V_IN_0_VOLT139 V_IN_1=V_IN_1_VOLT139 V_OUT_0=V_OUT_0_VOLT139 V_OUT_1=V_OUT_1_VOLT139
U_TOP_VOLTAGE/VOLT140: designators end in _VOLT140; ports V_IN_0=V_IN_0_VOLT140 V_IN_1=V_IN_1_VOLT140 V_OUT_0=V_OUT_0_VOLT140 V_OUT_1=V_OUT_1_VOLT140
U_TOP_VOLTAGE/VOLT141: designators end in _VOLT141; ports V_IN_0=V_IN_0_VOLT141 V_IN_1=V_IN_1_VOLT141 V_OUT_0=V_OUT_0_VOLT141 V_OUT_1=V_OUT_1_VOLT141
U_TOP_VOLTAGE/VOLT142: designators end in _VOLT142; ports V_IN_0=V_IN_0_VOLT142 V_IN_1=V_IN_1_VOLT142 V_OUT_0=V_OUT_0_VOLT142 V_OUT_1=V_OUT_1_VOLT142
U_TOP_VOLTAGE/VOLT143: designators end in _VOLT143; ports V_IN_0=V_IN_0_VOLT143 V_IN_1=V_IN_1_VOLT143 V_OUT_0=V_OUT_0_VOLT143 V_OUT_1=V_OUT_1_VOLT143
U_TOP_VOLTAGE/VOLT144: designators end in _VOLT144; ports V_IN_0=V_IN_0_VOLT144 V_IN_1=V_IN_1_VOLT144 V_OUT_0=V_OUT_0_VOLT144 V_OUT_1=V_OUT_1_VOLT144
U_TOP_VOLTAGE/VOLT145: designators end in _VOLT145; ports V_IN_0=V_IN_0_VOLT145 V_IN_1=V_IN_1_VOLT145 V_OUT_0=V_OUT_0_VOLT145 V_OUT_1=V_OUT_1_VOLT145
U_TOP_VOLTAGE/VOLT146: designators end in _VOLT146; ports V_IN_0=V_IN_0_VOLT146 V_IN_1=V_IN_1_VOLT146 V_OUT_0=V_OUT_0_VOLT146 V_OUT_1=V_OUT_1_VOLT146
U_TOP_VOLTAGE/VOLT147: designators end in _VOLT147; ports V_IN_0=V_IN_0_VOLT147 V_IN_1=V_IN_1_VOLT147 V_OUT_0=V_OUT_0_VOLT147 V_OUT_1=V_OUT_1_VOLT147
U_TOP_VOLTAGE/VOLT148: designators end in _VOLT148; ports V_IN_0=V_IN_0_VOLT148 V_IN_1=V_IN_1_VOLT148 V_OUT_0=V_OUT_0_VOLT148 V_OUT_1=V_OUT_1_VOLT148
U_TOP_VOLTAGE/VOLT149: designators end in _VOLT149; ports V_IN_0=V_IN_0_VOLT149 V_IN_1=V_IN_1_VOLT149 V_OUT_0=V_OUT_0_VOLT149 V_OUT_1=V_OUT_1_VOLT149
U_TOP_VOLTAGE/VOLT150: designators end in _VOLT150; ports V_IN_0=V_IN_0_VOLT150 V_IN_1=V_IN_1_VOLT150 V_OUT_0=V_OUT_0_VOLT150 V_OUT_1=V_OUT_1_VOLT150
U_TOP_VOLTAGE/VOLT151: designators end in _VOLT151; ports V_IN_0=V_IN_0_VOLT151 V_IN_1=V_IN_1_VOLT151 V_OUT_0=V_OUT_0_VOLT151 V_OUT_1=V_OUT_1_VOLT151
U_TOP_VOLTAGE/VOLT152: designators end in _VOLT152; ports V_IN_0=V_IN_0_VOLT152 V_IN_1=V_IN_1_VOLT152 V_OUT_0=V_OUT_0_VOLT152 V_OUT_1=V_OUT_1_VOLT152
U_TOP_VOLTAGE/VOLT153: designators end in _VOLT153; ports V_IN_0=V_IN_0_VOLT153 V_IN_1=V_IN_1_VOLT153 V_OUT_0=V_OUT_0_VOLT153 V_OUT_1=V_OUT_1_VOLT153
U_TOP_VOLTAGE/VOLT154: designators end in _VOLT154; ports V_IN_0=V_IN_0_VOLT154 V_IN_1=V_IN_1_VOLT154 V_OUT_0=V_OUT_0_VOLT154 V_OUT_1=V_OUT_1_VOLT154
U_TOP_VOLTAGE/VOLT155: designators end in _VOLT155; ports V_IN_0=V_IN_0_VOLT155 V_IN_1=V_IN_1_VOLT155 V_OUT_0=V_OUT_0_VOLT155 V_OUT_1=V_OUT_1_VOLT155
U_TOP_VOLTAGE/VOLT156: designators end in _VOLT156; ports V_IN_0=V_IN_0_VOLT156 V_IN_1=V_IN_1_VOLT156 V_OUT_0=V_OUT_0_VOLT156 V_OUT_1=V_OUT_1_VOLT156
U_TOP_VOLTAGE/VOLT157: designators end in _VOLT157; ports V_IN_0=V_IN_0_VOLT157 V_IN_1=V_IN_1_VOLT157 V_OUT_0=V_OUT_0_VOLT157 V_OUT_1=V_OUT_1_VOLT157
U_TOP_VOLTAGE/VOLT158: designators end in _VOLT158; ports V_IN_0=V_IN_0_VOLT158 V_IN_1=V_IN_1_VOLT158 V_OUT_0=V_OUT_0_VOLT158 V_OUT_1=V_OUT_1_VOLT158
U_TOP_VOLTAGE/VOLT159: designators end in _VOLT159; ports V_IN_0=V_IN_0_VOLT159 V_IN_1=V_IN_1_VOLT159 V_OUT_0=V_OUT_0_VOLT159 V_OUT_1=V_OUT_1_VOLT159
U_TOP_VOLTAGE/VOLT160: designators end in _VOLT160; ports V_IN_0=V_IN_0_VOLT160 V_IN_1=V_IN_1_VOLT160 V_OUT_0=V_OUT_0_VOLT160 V_OUT_1=V_OUT_1_VOLT160

### Library data of the parts
C34 = Cap: Capacitor; Published: 8-Jun-2000; LatestRevisionDate: 17-Jul-2002; LatestRevisionNote: Re-released for DXP Platform.; PackageReference: RAD-0.3; Publisher: Altium Limited; PackageDescription: Radial Cap, Thru-Hole; 2 Leads; 0.3 in Pin Spacing; Value: 0.1uF/50V
R26-R29 = Res1: Resistor; Published: 8-Jun-2000; LatestRevisionDate: 17-Jul-2002; LatestRevisionNote: Re-released for DXP Platform.; PackageReference: AXIAL-0.3; Publisher: Altium Limited; PackageDescription: Axial Device, Thru-Hole; 2 Leads; 0.3 in Pin Spacing; Value: 1K
U9 = IX4427MTR: Integrated Circuit; Manufacturer_Name: IXYS SEMICONDUCTOR; Datasheet Link: http://www.ixysic.com/home/pdfs.nsf/www/IX4426-27-28.pdf/$file/IX4426-27-28.pdf; Height: 0.9mm; Manufacturer_Part_Number: IX4427MTR; Arrow Part Number: IX4427MTR; Arrow Price/Stock: https://www.arrow.com/en/products/ix4427mtr/ixys; Mouser Part Number: 849-IX4427MTR; Mouser Price/Stock: https://www.mouser.co.uk/ProductDetail/IXYS-Integrated-Circuits/IX4427MTR/?qs=KD90HyCcfIn4cdMeKdxOsg%3D%3D

## Sheet VoltageHeaders.SchDoc
size B
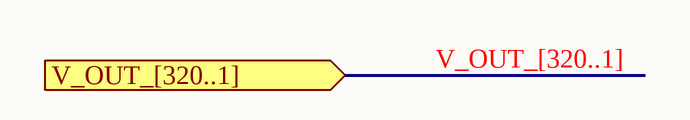
[diagram p6: VoltageHeaders.SchDoc]

### Ports
V_OUT_[320..1] (in)

### Buses and harness runs
bus V_OUT_[320..1] = port V_OUT_[320..1]

## Sheet TOP_CONTROLLER.SchDoc
size A3
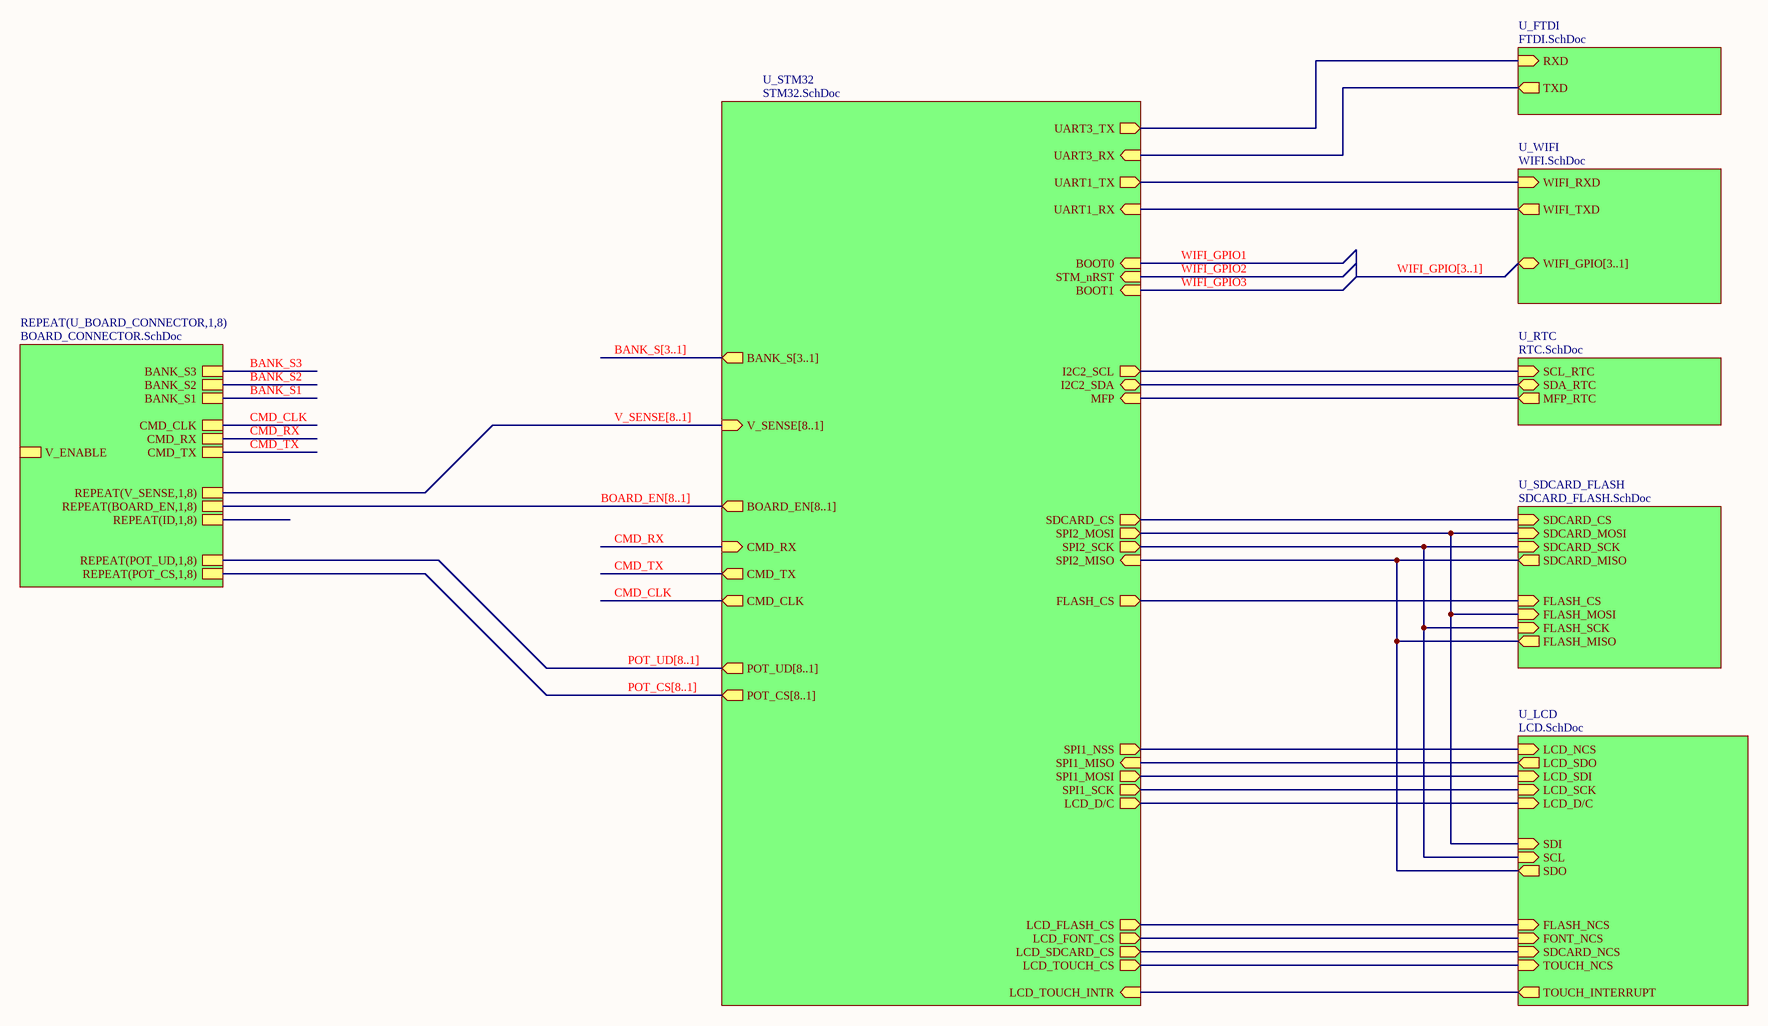
[diagram p7: TOP_CONTROLLER.SchDoc]

### Sub-sheets
REPEAT(U_BOARD_CONNECTOR,1,8) = BOARD_CONNECTOR.SchDoc: BANK_S3, BANK_S2, BANK_S1, CMD_CLK, REPEAT(POT_CS,1,8), CMD_TX, REPEAT(POT_UD,1,8), CMD_RX, V_ENABLE, REPEAT(BOARD_EN,1,8), REPEAT(V_SENSE,1,8), REPEAT(ID,1,8)
U_FTDI = FTDI.SchDoc (file not in this document): TXD (out), RXD (in)
U_LCD = LCD.SchDoc: TOUCH_INTERRUPT (out), SDO (out), SCL (in), SDI (in), FLASH_NCS (in), FONT_NCS (in), SDCARD_NCS (in), TOUCH_NCS (in), LCD_SCK (in), LCD_SDI (in), LCD_SDO (out), LCD_NCS (in), LCD_D/C (in)
U_RTC = RTC.SchDoc (file not in this document): SCL_RTC (in), SDA_RTC (bidir), MFP_RTC (out)
U_SDCARD_FLASH = SDCARD_FLASH.SchDoc: SDCARD_CS (in), SDCARD_MOSI (in), SDCARD_SCK (in), SDCARD_MISO (out), FLASH_CS (in), FLASH_MISO (out), FLASH_SCK (in), FLASH_MOSI (in)
U_STM32 = STM32.SchDoc: SPI1_NSS (out), SPI1_MOSI (out), SPI1_MISO (in), SPI1_SCK (out), SPI2_MOSI (out), SPI2_MISO (in), SPI2_SCK (out), I2C2_SCL (out), I2C2_SDA (bidir), UART1_TX (out), UART1_RX (in), UART3_RX (in), UART3_TX (out), CMD_CLK (out), CMD_TX (out), STM_nRST (in), V_SENSE[8..1] (in), BOOT0 (in), BOARD_EN[8..1] (out), BOOT1 (in), CMD_RX (in), MFP (in), FLASH_CS (out), SDCARD_CS (out), LCD_D/C (out), LCD_TOUCH_INTR (in), LCD_TOUCH_CS (out), LCD_FONT_CS (out), LCD_FLASH_CS (out), LCD_SDCARD_CS (out), BANK_S[3..1] (out), POT_UD[8..1] (out), POT_CS[8..1] (out)
U_WIFI = WIFI.SchDoc: WIFI_RXD (in), WIFI_TXD (out), WIFI_GPIO[3..1] (bidir)

### Nets
CMD_CLK: sheet U_STM32/CMD_CLK, sheet REPEAT(U_BOARD_CONNECTOR,1,8)/CMD_CLK
CMD_RX: sheet U_STM32/CMD_RX, sheet REPEAT(U_BOARD_CONNECTOR,1,8)/CMD_RX
CMD_TX: sheet U_STM32/CMD_TX, sheet REPEAT(U_BOARD_CONNECTOR,1,8)/CMD_TX
FLASH_CS: sheet U_STM32/FLASH_CS, sheet U_SDCARD_FLASH/FLASH_CS
FLASH_MISO: sheet U_STM32/SPI2_MISO, sheet U_SDCARD_FLASH/SDCARD_MISO, sheet U_SDCARD_FLASH/FLASH_MISO, sheet U_LCD/SDO
FLASH_MOSI: sheet U_STM32/SPI2_MOSI, sheet U_SDCARD_FLASH/SDCARD_MOSI, sheet U_SDCARD_FLASH/FLASH_MOSI, sheet U_LCD/SDI
FLASH_NCS: sheet U_STM32/LCD_FLASH_CS, sheet U_LCD/FLASH_NCS
FLASH_SCK: sheet U_STM32/SPI2_SCK, sheet U_SDCARD_FLASH/SDCARD_SCK, sheet U_SDCARD_FLASH/FLASH_SCK, sheet U_LCD/SCL
FONT_NCS: sheet U_STM32/LCD_FONT_CS, sheet U_LCD/FONT_NCS
I2C2_SCL: sheet U_RTC/SCL_RTC, sheet U_STM32/I2C2_SCL
I2C2_SDA: sheet U_RTC/SDA_RTC, sheet U_STM32/I2C2_SDA
LCD_D/C: sheet U_STM32/LCD_D/C, sheet U_LCD/LCD_D/C
LCD_NCS: sheet U_STM32/SPI1_NSS, sheet U_LCD/LCD_NCS
LCD_SCK: sheet U_STM32/SPI1_SCK, sheet U_LCD/LCD_SCK
LCD_SDCARD_CS: sheet U_STM32/LCD_SDCARD_CS, sheet U_LCD/SDCARD_NCS
LCD_SDI: sheet U_STM32/SPI1_MOSI, sheet U_LCD/LCD_SDI
LCD_SDO: sheet U_STM32/SPI1_MISO, sheet U_LCD/LCD_SDO
LCD_TOUCH_CS: sheet U_STM32/LCD_TOUCH_CS, sheet U_LCD/TOUCH_NCS
LCD_TOUCH_INTR: sheet U_STM32/LCD_TOUCH_INTR, sheet U_LCD/TOUCH_INTERRUPT
MFP: sheet U_RTC/MFP_RTC, sheet U_STM32/MFP
SDCARD_CS: sheet U_STM32/SDCARD_CS, sheet U_SDCARD_FLASH/SDCARD_CS
UART1_RX: sheet U_WIFI/WIFI_TXD, sheet U_STM32/UART1_RX
UART1_TX: sheet U_WIFI/WIFI_RXD, sheet U_STM32/UART1_TX
UART3_RX: sheet U_FTDI/TXD, sheet U_STM32/UART3_RX
UART3_TX: sheet U_FTDI/RXD, sheet U_STM32/UART3_TX

### Buses and harness runs
bus BANK_S[3..1] = sheet U_STM32/BANK_S[3..1]
bus BOARD_EN[8..1] = sheet U_STM32/BOARD_EN[8..1]
bus POT_CS[8..1] = sheet U_STM32/POT_CS[8..1]
bus POT_UD[8..1] = sheet U_STM32/POT_UD[8..1]
bus V_SENSE[8..1] = sheet U_STM32/V_SENSE[8..1]
bus WIFI_GPIO[3..1] = sheet U_WIFI/WIFI_GPIO[3..1]

## Sheet WIFI.SchDoc
size B
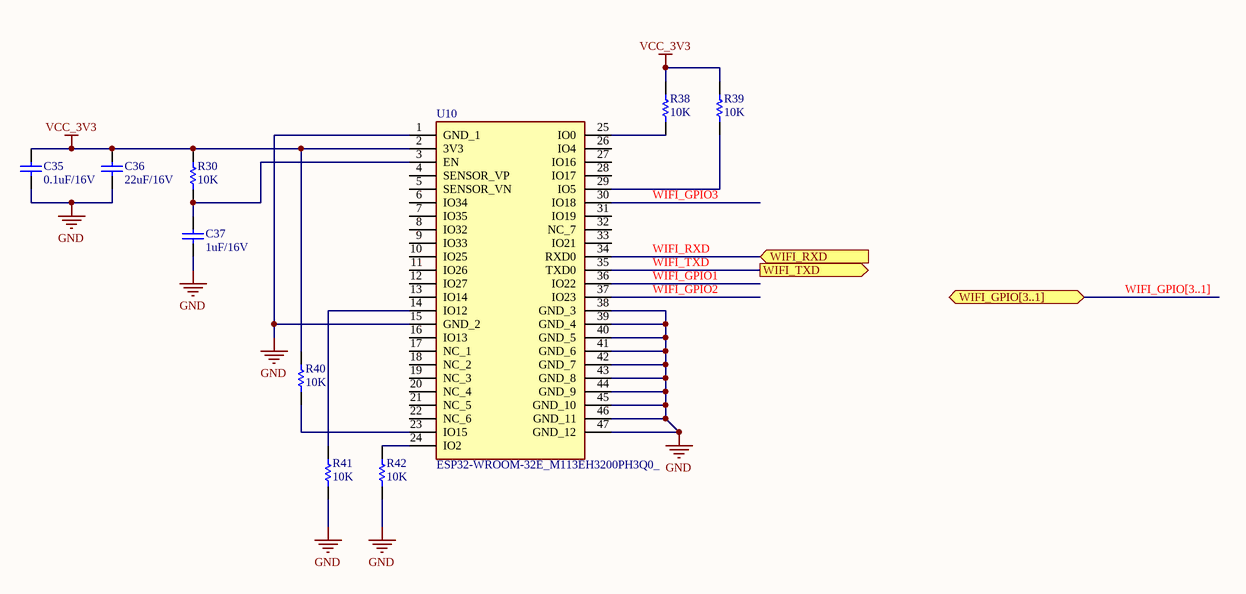
[diagram p8: WIFI.SchDoc]

### Parts
C35  0.1uF/16V  [RAD-0.3]
C36  22uF/16V  [RAD-0.3]
C37  1uF/16V  [RAD-0.3]
R30  10K  [AXIAL-0.3]
R38  10K  [AXIAL-0.3]
R39  10K  [AXIAL-0.3]
R40  10K  [AXIAL-0.3]
R41  10K  [AXIAL-0.3]
R42  10K  [AXIAL-0.3]
U10  ESP32-WROOM-32E_M113EH3200PH3Q0_  [ESP32WROOM32EM113EH3200PH3Q0]

### Ports
WIFI_GPIO[3..1] (bidir), WIFI_RXD (in), WIFI_TXD (out)

### Nets
GND: C35.2 C36.2 C37.2 R41.2 R42.2 U10.1(GND_1) U10.15(GND_2) U10.38(GND_3) U10.39(GND_4) U10.40(GND_5) U10.41(GND_6) U10.42(GND_7) U10.43(GND_8) U10.44(GND_9) U10.45(GND_10) U10.46(GND_11) U10.47(GND_12)  [project net CMD_EN]
VCC_3V3: C35.1 C36.1 R30.1 R38.1 R39.1 R40.1 U10.2(3V3)  [project net RESET_N]
WIFI_GPIO1: U10.36(IO22)  [project net BOOT0]
WIFI_GPIO2: U10.37(IO23)  [project net STM_nRST]
WIFI_GPIO3: U10.30(IO18)  [project net BOOT1]
WIFI_RXD: U10.34(RXD0) ; port WIFI_RXD  [project net UART1_TX]
WIFI_TXD: U10.35(TXD0) ; port WIFI_TXD  [project net UART1_RX]
NetC37_1: C37.1 R30.2 U10.3(EN)
NetR38_2: R38.2 U10.25(IO0)
NetR39_2: R39.2 U10.29(IO5)
NetR40_2: R40.2 U10.23(IO15)
NetR41_1: R41.1 U10.14(IO12)
NetR42_1: R42.1 U10.24(IO2)

Not connected (* = marked no-connect by the designer): U10 4(SENSOR_VP) 5(SENSOR_VN) 6(IO34) 7(IO35) 8(IO32) 9(IO33) 10(IO25) 11(IO26) 12(IO27) 13(IO14) 16(IO13) 17(NC_1) 18(NC_2) 19(NC_3) 20(NC_4) 21(NC_5) 22(NC_6) 26(IO4) 27(IO16) 28(IO17) 31(IO19) 32(NC_7) 33(IO21)

### Buses and harness runs
bus WIFI_GPIO[3..1] = port WIFI_GPIO[3..1]

### Library data of the parts
C35-C37 = Cap: Capacitor; Published: 8-Jun-2000; LatestRevisionDate: 17-Jul-2002; LatestRevisionNote: Re-released for DXP Platform.; PackageReference: RAD-0.3; Publisher: Altium Limited; PackageDescription: Radial Cap, Thru-Hole; 2 Leads; 0.3 in Pin Spacing
  C35: Value: 0.1uF/16V
  C36: Value: 22uF/16V
  C37: Value: 1uF/16V
R30 R38-R42 = Res1: Resistor; Published: 8-Jun-2000; LatestRevisionDate: 17-Jul-2002; LatestRevisionNote: Re-released for DXP Platform.; PackageReference: AXIAL-0.3; Publisher: Altium Limited; PackageDescription: Axial Device, Thru-Hole; 2 Leads; 0.3 in Pin Spacing; Value: 10K
U10 = ESP32-WROOM-32E_M113EH3200PH3Q0_: Integrated Circuit; Manufacturer_Name: Espressif Systems; Manufacturer_Part_Number: ESP32-WROOM-32E(M113EH3200PH3Q0); Datasheet Link: https://www.mouser.com/datasheet/2/891/esp32-wroom-32e_esp32-wroom-32ue_datasheet_en-1855879.pdf; Height: 3.25mm; Mouser Part Number: 356-ESP32WRM32E132PH; Mouser Price/Stock: https://www.mouser.co.uk/ProductDetail/Espressif-Systems/ESP32-WROOM-32EM113EH3200PH3Q0/?qs=vHuUswq2%252Bsx8Xcp7bzmaHA%3D%3D

## Sheet STM32.SchDoc
size 508 x 281 mm
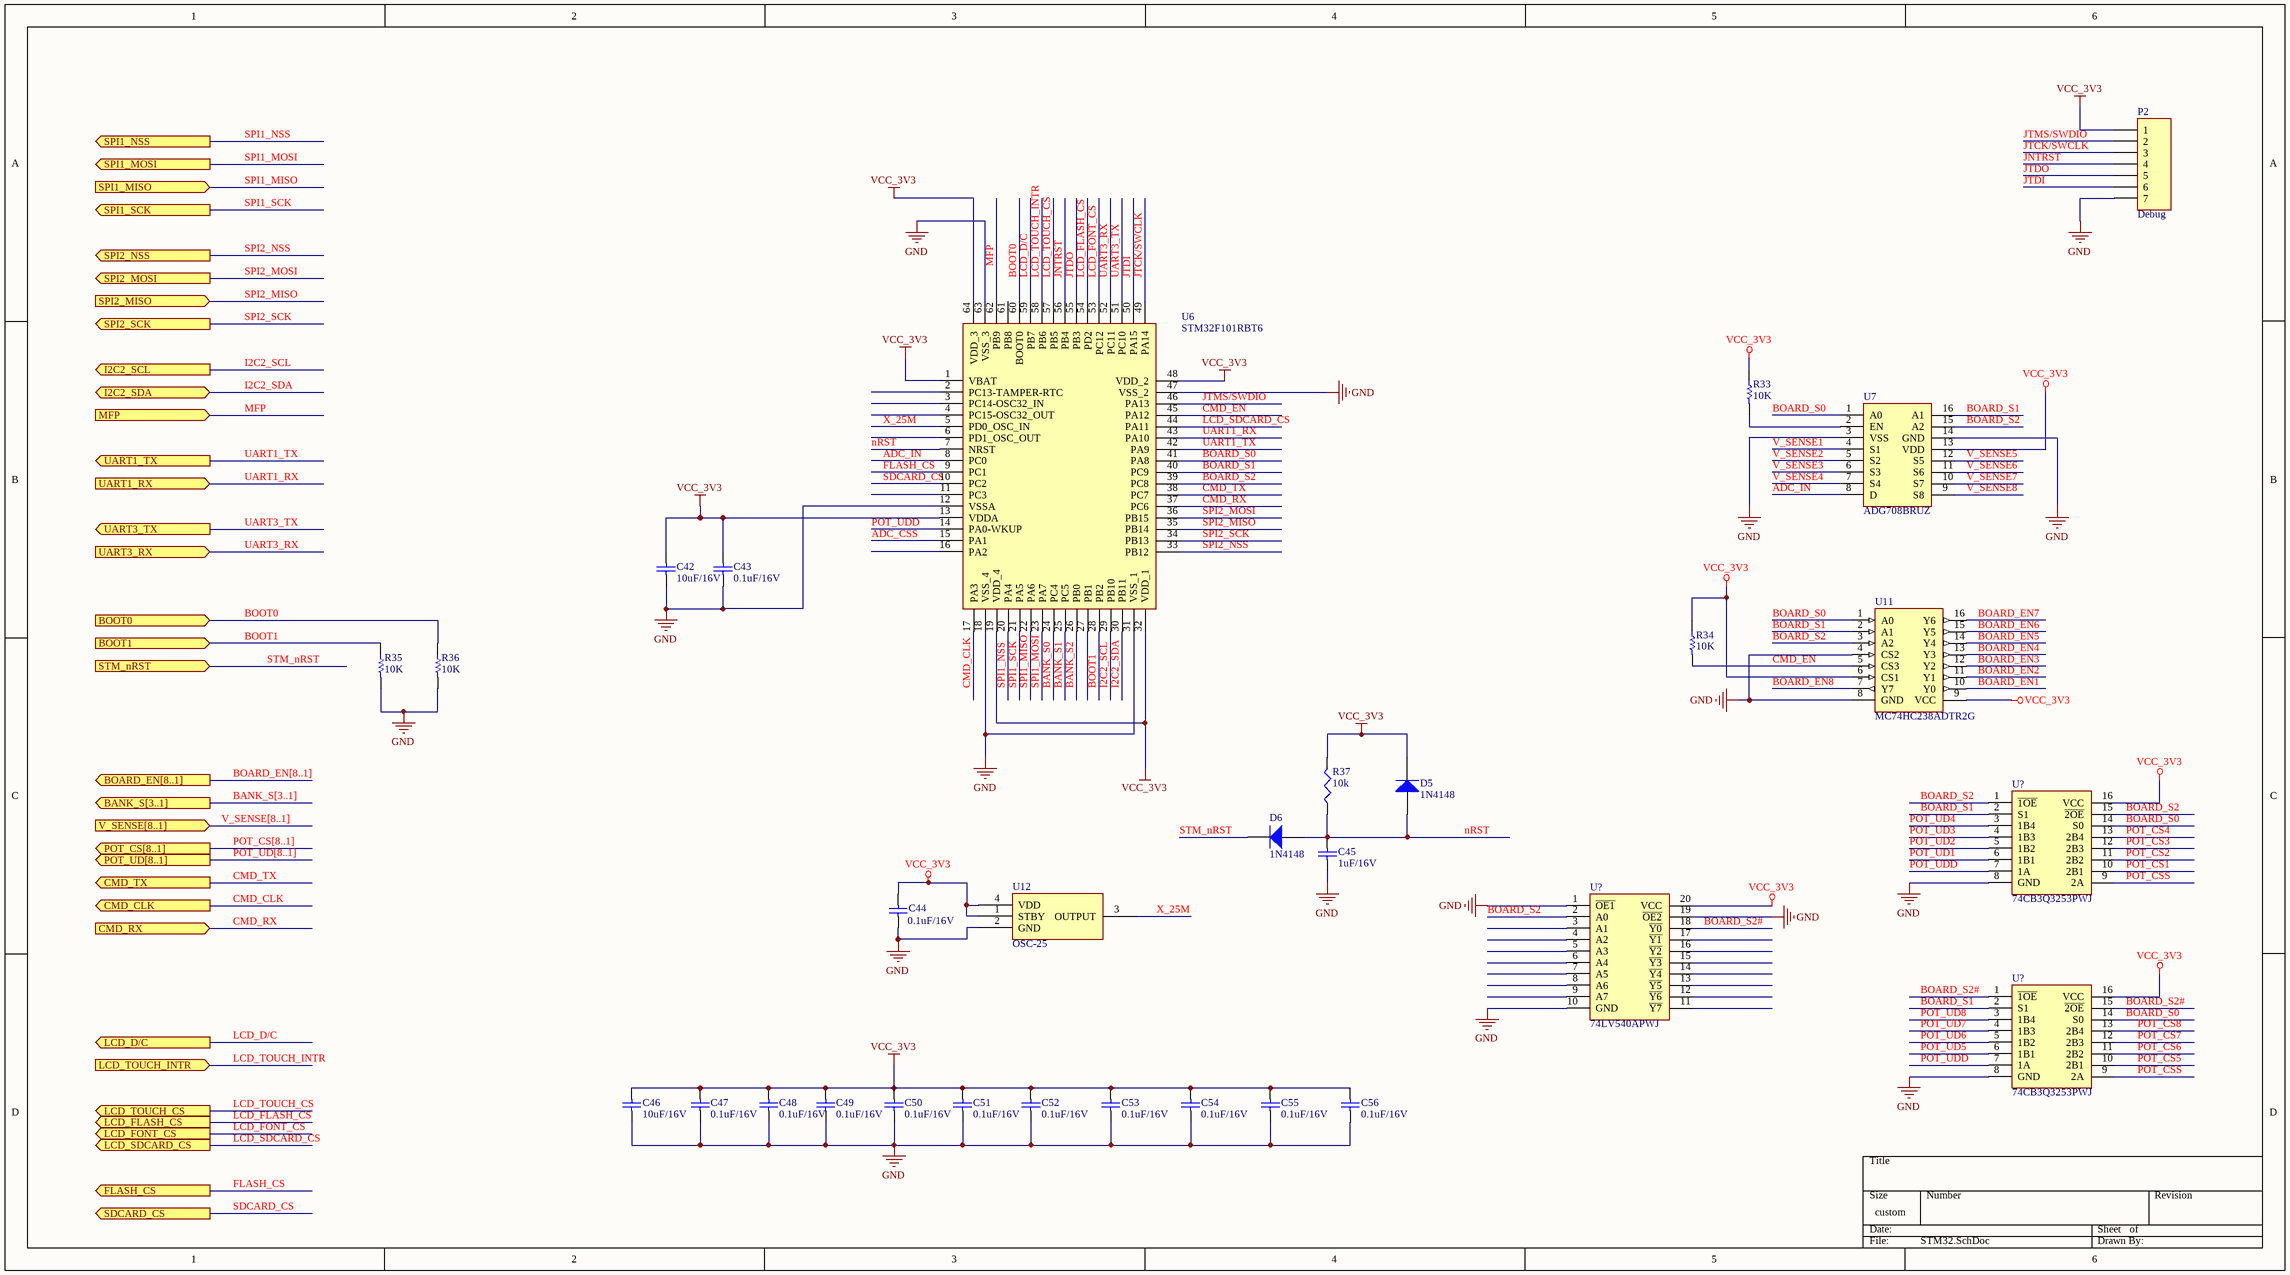
[diagram p9: STM32.SchDoc]

### Parts
(Parts that share a designator on the sheet are numbered #1, #2 ... from top to bottom, then left to right.)
C42  10uF/16V  [RAD-0.3]
C43  0.1uF/16V  [RAD-0.3]
C44  0.1uF/16V  [0402_CAP]
C45  1uF/16V  [RAD-0.3]
C46  10uF/16V  [RAD-0.3]
C47  0.1uF/16V  [RAD-0.3]
C48  0.1uF/16V  [RAD-0.3]
C49  0.1uF/16V  [RAD-0.3]
C50  0.1uF/16V  [RAD-0.3]
C51  0.1uF/16V  [RAD-0.3]
C52  0.1uF/16V  [RAD-0.3]
C53  0.1uF/16V  [RAD-0.3]
C54  0.1uF/16V  [RAD-0.3]
C55  0.1uF/16V  [RAD-0.3]
C56  0.1uF/16V  [RAD-0.3]
D5  1N4148  [1N4148W-13-F]
D6  1N4148  [1N4148W-13-F]
P2  Debug  [HDR1X7]
R33  10K  [AXIAL-0.3]
R34  10K  [AXIAL-0.3]
R35  10K  [AXIAL-0.3]
R36  10K  [AXIAL-0.3]
R37  10k  [0402_RES]
U6  STM32F101RBT6  [QFP50P1200X1200X160-64N]
U7  ADG708BRUZ  [SOP65P640X120-16N]
U11  MC74HC238ADTR2G  [SOP65P640X120-16N]
U12  OSC-25  [ASE-25.000MHZ-LC-T]
U?#1  74CB3Q3253PWJ  [SOP65P640X110-16N]
U?#2  74LV540APWJ  [SOP65P640X110-20N]
U?#3  74CB3Q3253PWJ  [SOP65P640X110-16N]

### Ports
BANK_S[3..1] (out), BOARD_EN[8..1] (out), BOOT0 (in), BOOT1 (in), CMD_CLK (out), CMD_RX (in), CMD_TX (out), FLASH_CS (out), I2C2_SCL (out), I2C2_SDA (bidir), LCD_D/C (out), LCD_FLASH_CS (out), LCD_FONT_CS (out), LCD_SDCARD_CS (out), LCD_TOUCH_CS (out), LCD_TOUCH_INTR (in), MFP (in), POT_CS[8..1] (out), POT_UD[8..1] (out), SDCARD_CS (out), SPI1_MISO (in), SPI1_MOSI (out), SPI1_NSS (out), SPI1_SCK (out), SPI2_MISO (in), SPI2_MOSI (out), SPI2_NSS (out), SPI2_SCK (out), STM_nRST (in), UART1_RX (in), UART1_TX (out), UART3_RX (in), UART3_TX (out), V_SENSE[8..1] (in)

### Nets
GND: C42.2 C43.2 C44.1 C45.2 C46.2 C47.2 C48.2 C49.2 C50.2 C51.2 C52.2 C53.2 C54.2 C55.2 C56.2 P2.7 R35.2 R36.2 U6.12(VSSA) U6.18(VSS_4) U6.31(VSS_1) U6.47(VSS_2) U6.63(VSS_3) U7.3(VSS) U7.14(GND) U11.4(CS2) U11.8(GND) U12.2(GND) U?#1.8(GND) U?#2.1(~{OE1}) U?#2.10(GND) U?#2.19(~{OE2}) U?#3.8(GND)  [project net CMD_EN]
VCC_3V3: C42.1 C43.1 C44.2 C46.1 C47.1 C48.1 C49.1 C50.1 C51.1 C52.1 C53.1 C54.1 C55.1 C56.1 D5.2(K) P2.1 R33.1 R34.1 R37.2 U6.1(VBAT) U6.13(VDDA) U6.19(VDD_4) U6.32(VDD_1) U6.48(VDD_2) U6.64(VDD_3) U7.13(VDD) U11.6(CS1) U11.9(VCC) U12.1(STBY) U12.4(VDD) U?#1.16(VCC) U?#2.20(VCC) U?#3.16(VCC)  [project net RESET_N]
ADC_CSS: U6.15(PA1)
ADC_IN: U6.8(PC0) U7.8(D)
BANK_S0: U6.24(PC4)
BANK_S1: U6.25(PC5)
BANK_S2: U6.26(PB0)
BOARD_EN1: U11.10(Y0)
BOARD_EN2: U11.11(Y1)
BOARD_EN3: U11.12(Y2)
BOARD_EN4: U11.13(Y3)
BOARD_EN5: U11.14(Y4)
BOARD_EN6: U11.15(Y5)
BOARD_EN7: U11.16(Y6)
BOARD_EN8: U11.7(Y7)
BOARD_S0: U6.41(PA8) U7.1(A0) U11.1(A0) U?#1.14(S0) U?#3.14(S0)
BOARD_S1: U6.40(PC9) U7.16(A1) U11.2(A1) U?#1.2(S1) U?#3.2(S1)
BOARD_S2: U6.39(PC8) U7.15(A2) U11.3(A2) U?#1.1(~{1OE}) U?#1.15(~{2OE}) U?#2.2(A0)
BOARD_S2#: U?#2.18(~{Y0}) U?#3.1(~{1OE}) U?#3.15(~{2OE})
BOOT0: R36.1 U6.60(BOOT0) ; port BOOT0
BOOT1: R35.1 U6.28(PB2) ; port BOOT1
CMD_CLK: U6.17(PA3) ; port CMD_CLK
CMD_EN: R34.2 U6.45(PA12) U11.5(CS3)
CMD_RX: U6.37(PC6) ; port CMD_RX
CMD_TX: U6.38(PC7) ; port CMD_TX
FLASH_CS: U6.9(PC1) ; port FLASH_CS
I2C2_SCL: U6.29(PB10) ; port I2C2_SCL
I2C2_SDA: U6.30(PB11) ; port I2C2_SDA
JNTRST: P2.4 U6.56(PB4)
JTCK/SWCLK: P2.3 U6.49(PA14)
JTDI: P2.6 U6.50(PA15)
JTDO: P2.5 U6.55(PB3)
JTMS/SWDIO: P2.2 U6.46(PA13)
LCD_D/C: U6.59(PB7) ; port LCD_D/C
LCD_FLASH_CS: U6.54(PD2) ; port LCD_FLASH_CS  [project net FLASH_NCS]
LCD_FONT_CS: U6.53(PC12) ; port LCD_FONT_CS  [project net FONT_NCS]
LCD_SDCARD_CS: U6.44(PA11) ; port LCD_SDCARD_CS
LCD_TOUCH_CS: U6.57(PB5) ; port LCD_TOUCH_CS
LCD_TOUCH_INTR: U6.58(PB6) ; port LCD_TOUCH_INTR
MFP: U6.62(PB9) ; port MFP
nRST: C45.1 D5.1(A) D6.1(A) R37.1 U6.7(NRST)
POT_CS1: U?#1.10(2B1)
POT_CS2: U?#1.11(2B2)
POT_CS3: U?#1.12(2B3)
POT_CS4: U?#1.13(2B4)
POT_CS5: U?#3.10(2B1)
POT_CS6: U?#3.11(2B2)
POT_CS7: U?#3.12(2B3)
POT_CS8: U?#3.13(2B4)
POT_CSS: U?#1.9(2A) U?#3.9(2A)
POT_UD1: U?#1.6(1B1)
POT_UD2: U?#1.5(1B2)
POT_UD3: U?#1.4(1B3)
POT_UD4: U?#1.3(1B4)
POT_UD5: U?#3.6(1B1)
POT_UD6: U?#3.5(1B2)
POT_UD7: U?#3.4(1B3)
POT_UD8: U?#3.3(1B4)
POT_UDD: U6.14(PA0-WKUP) U?#1.7(1A) U?#3.7(1A)
SDCARD_CS: U6.10(PC2) ; port SDCARD_CS
SPI1_MISO: U6.22(PA6) ; port SPI1_MISO  [project net LCD_SDO]
SPI1_MOSI: U6.23(PA7) ; port SPI1_MOSI  [project net LCD_SDI]
SPI1_NSS: U6.20(PA4) ; port SPI1_NSS  [project net LCD_NCS]
SPI1_SCK: U6.21(PA5) ; port SPI1_SCK  [project net LCD_SCK]
SPI2_MISO: U6.35(PB14) ; port SPI2_MISO  [project net FLASH_MISO]
SPI2_MOSI: U6.36(PB15) ; port SPI2_MOSI  [project net FLASH_MOSI]
SPI2_NSS: U6.33(PB12) ; port SPI2_NSS
SPI2_SCK: U6.34(PB13) ; port SPI2_SCK  [project net FLASH_SCK]
STM_nRST: D6.2(K) ; port STM_nRST
UART1_RX: U6.43(PA10) ; port UART1_RX
UART1_TX: U6.42(PA9) ; port UART1_TX
UART3_RX: U6.52(PC11) ; port UART3_RX
UART3_TX: U6.51(PC10) ; port UART3_TX
V_SENSE1: U7.4(S1)
V_SENSE2: U7.5(S2)
V_SENSE3: U7.6(S3)
V_SENSE4: U7.7(S4)
V_SENSE5: U7.12(S5)
V_SENSE6: U7.11(S6)
V_SENSE7: U7.10(S7)
V_SENSE8: U7.9(S8)
X_25M: U6.5(PD0_OSC_IN) U12.3(OUTPUT)
NetR33_2: R33.2 U7.2(EN)

Not connected (* = marked no-connect by the designer): U6 2(PC13-TAMPER-RTC) 3(PC14-OSC32_IN) 4(PC15-OSC32_OUT) 6(PD1_OSC_OUT) 11(PC3) 16(PA2) 27(PB1) 61(PB8); U?#2 3(A1) 4(A2) 5(A3) 6(A4) 7(A5) 8(A6) 9(A7) 11(~{Y7}) 12(~{Y6}) 13(~{Y5}) 14(~{Y4}) 15(~{Y3}) 16(~{Y2}) 17(~{Y1})

### Buses and harness runs
bus BANK_S[3..1] = port BANK_S[3..1]
bus BOARD_EN[8..1] = port BOARD_EN[8..1]
bus POT_CS[8..1] = port POT_CS[8..1]
bus POT_UD[8..1] = port POT_UD[8..1]
bus V_SENSE[8..1] = port V_SENSE[8..1]

### Library data of the parts
C42 C43 C45-C56 = Cap: Capacitor; Published: 8-Jun-2000; LatestRevisionDate: 17-Jul-2002; LatestRevisionNote: Re-released for DXP Platform.; PackageReference: RAD-0.3; Publisher: Altium Limited; PackageDescription: Radial Cap, Thru-Hole; 2 Leads; 0.3 in Pin Spacing
  C42 C46: Value: 10uF/16V
  C43 C47-C56: Value: 0.1uF/16V
  C45: Value: 1uF/16V
C44 = Cap: Multilayer Ceramic Capacitors MLCC - SMD/SMT 10% AEC-Q200 16V 0.1uF X7R 0402; Mfr Part No: C0402T104K4RACTU; Manufacturer: KEMET; Value: 0.1uF/16V; Stockiest: MOUSER; Stockiest Part No: 80-C0402T104K4RACTU; Package: 0402; Price: 0.1
D5 D6 = Diode: Diodes - General Purpose, Power, Switching 400mW 100Vrrm 4ns; Value: 100V; Stockiest: MOUSER; Stockiest Part No: 621-1N4148W-13-F; Mfr Part No: 1N4148W-13-F; Package: SOD-123-2; Manufacturer: Diodes
P2 = Header 7: Header, 7-Pin; LatestRevisionDate: 17-Jul-2002; LatestRevisionNote: Re-released for DXP Platform.; Publisher: Altium Limited
R33-R36 = Res1: Resistor; Published: 8-Jun-2000; LatestRevisionDate: 17-Jul-2002; LatestRevisionNote: Re-released for DXP Platform.; PackageReference: AXIAL-0.3; Publisher: Altium Limited; PackageDescription: Axial Device, Thru-Hole; 2 Leads; 0.3 in Pin Spacing; Value: 10K
R37 = 0402_RES: Thick Film Resistors - SMD 10K OHM 1%; Manufacturer: Yageo; Mfr Part No: RC0402FR-0710KL; Package: 0402; Price: 0.1; Stockiest Part No: 603-RC0402FR-0710KL; Value: 10k; Stockiest: MOUSER
U6 = STM32F101RBT6: Integrated Circuit; Manufacturer_Name: STMicroelectronics; Datasheet Link: http://www.st.com/st-web-ui/static/active/en/resource/technical/document/datasheet/CD00161561.pdf; Height: 1.6mm; Manufacturer_Part_Number: STM32F101RBT6; Arrow Part Number: STM32F101RBT6; Arrow Price/Stock: https://www.arrow.com/en/products/stm32f101rbt6/stmicroelectronics; Mouser Part Number: 511-STM32F101RBT6; Mouser Price/Stock: https://www.mouser.co.uk/ProductDetail/STMicroelectronics/STM32F101RBT6?qs=bhCVus9SdFt0EKpQgWIkhA%3D%3D
U7 = ADG708BRUZ: Integrated Circuit; Manufacturer_Name: Analog Devices; Datasheet Link: http://www.analog.com/static/imported-files/data_sheets/ADG708_709.pdf; Height: 1.2mm; Manufacturer_Part_Number: ADG708BRUZ; Arrow Part Number: ADG708BRUZ; Arrow Price/Stock: https://www.arrow.com/en/products/adg708bruz/analog-devices; Mouser Part Number: 584-ADG708BRUZ; Mouser Price/Stock: https://www.mouser.co.uk/ProductDetail/Analog-Devices/ADG708BRUZ?qs=BpaRKvA4VqE6s2wNpzXc6Q%3D%3D
U11 = MC74HC238ADTR2G: Integrated Circuit; Manufacturer_Name: ON Semiconductor; Datasheet Link: https://componentsearchengine.com/Datasheets/2/MC74HC238ADTR2G.pdf; Height: 1.2mm; Manufacturer_Part_Number: MC74HC238ADTR2G; Arrow Part Number: MC74HC238ADTR2G; Arrow Price/Stock: https://www.arrow.com/en/products/mc74hc238adtr2g/on-semiconductor; Mouser Part Number: 863-MC74HC238ADTR2G; Mouser Price/Stock: https://www.mouser.co.uk/ProductDetail/ON-Semiconductor/MC74HC238ADTR2G?qs=mB5q98eOMcYIHVTp70gNug%3D%3D
U12 = CRYSTAL: Standard Clock Oscillators 25.0 MHZ 3.3V 50PPM SMD 32; Manufacturer: Abracon; Value: 25MHZ; Stockiest: MOUSER; Stockiest Part No: 815-ASE25.000MHZLCT; Mfr Part No: ASE-25.000MHZ-LC-T; Package: SMD; Price: 1.5
U?#1 U?#3 = 74CB3Q3253PWJ: Integrated Circuit; Manufacturer_Name: Nexperia; Datasheet Link: https://assets.nexperia.com/documents/data-sheet/74CB3Q3253.pdf; Height: 1.1mm; Manufacturer_Part_Number: 74CB3Q3253PWJ; Arrow Part Number: 74CB3Q3253PWJ; Arrow Price/Stock: https://www.arrow.com/en/products/74cb3q3253pwj/nexperia; Mouser Part Number: 771-74CB3Q3253PWJ; Mouser Price/Stock: https://www.mouser.co.uk/ProductDetail/Nexperia/74CB3Q3253PWJ?qs=YCa%2FAAYMW0039vRtZ2fz%252BA%3D%3D
U?#2 = 74LV540APWJ: Integrated Circuit; Manufacturer_Name: Nexperia; Datasheet Link: https://assets.nexperia.com/documents/data-sheet/74LV540A.pdf; Height: 1.1mm; Manufacturer_Part_Number: 74LV540APWJ; Arrow Part Number: 74LV540APWJ; Arrow Price/Stock: https://www.arrow.com/en/products/74lv540apwj/nexperia; Mouser Part Number: 771-74LV540APWJ; Mouser Price/Stock: https://www.mouser.com/Search/Refine.aspx?Keyword=771-74LV540APWJ

## Sheet SDCARD_FLASH.SchDoc
size B
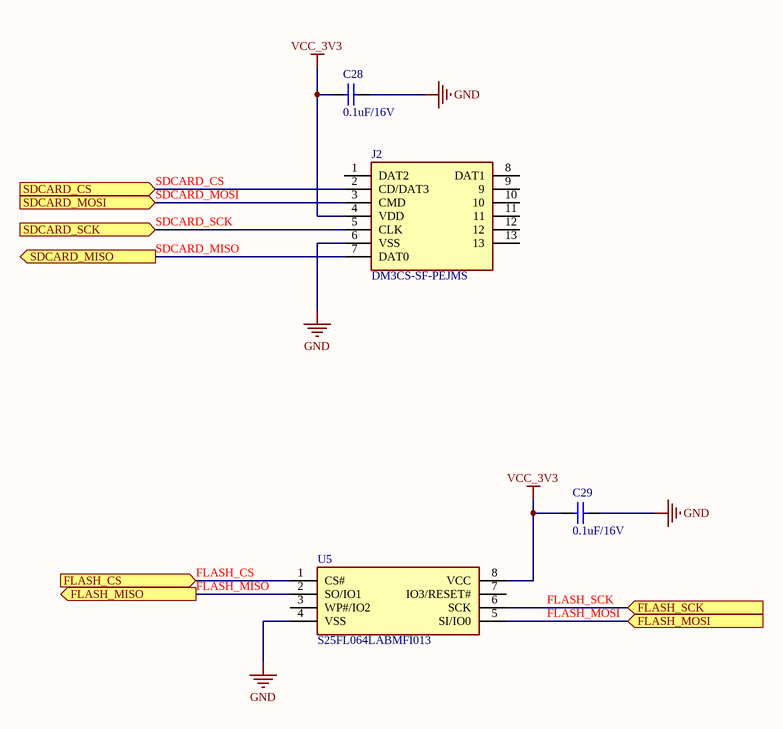
[diagram p10: SDCARD_FLASH.SchDoc]

### Parts
C28  0.1uF/16V  [RAD-0.3]
C29  0.1uF/16V  [RAD-0.3]
J2  DM3CS-SF-PEJMS  [DM3CSSFPEJMS]
U5  S25FL064LABMFI013  [SOIC127P800X216-8N]

### Ports
FLASH_CS (in), FLASH_MISO (out), FLASH_MOSI (in), FLASH_SCK (in), SDCARD_CS (in), SDCARD_MISO (out), SDCARD_MOSI (in), SDCARD_SCK (in)

### Nets
GND: C28.1 C29.1 J2.6(VSS) U5.4(VSS)  [project net CMD_EN]
VCC_3V3: C28.2 C29.2 J2.4(VDD) U5.8(VCC)  [project net RESET_N]
FLASH_CS: U5.1(CS#) ; port FLASH_CS
FLASH_MISO: J2.7(DAT0) U5.2(SO/IO1) ; port SDCARD_MISO, port FLASH_MISO  [also labelled SDCARD_MISO]
FLASH_MOSI: J2.3(CMD) U5.5(SI/IO0) ; port SDCARD_MOSI, port FLASH_MOSI  [also labelled SDCARD_MOSI]
FLASH_SCK: J2.5(CLK) U5.6(SCK) ; port SDCARD_SCK, port FLASH_SCK  [also labelled SDCARD_SCK]
SDCARD_CS: J2.2(CD/DAT3) ; port SDCARD_CS

Not connected (* = marked no-connect by the designer): J2 1(DAT2) 8(DAT1) 9 10 11 12 13; U5 3(WP#/IO2) 7(IO3/RESET#)

### Library data of the parts
C28 C29 = Cap: Capacitor; Published: 8-Jun-2000; LatestRevisionDate: 17-Jul-2002; LatestRevisionNote: Re-released for DXP Platform.; PackageReference: RAD-0.3; Publisher: Altium Limited; PackageDescription: Radial Cap, Thru-Hole; 2 Leads; 0.3 in Pin Spacing; Value: 0.1uF/16V
J2 = DM3CS-SF-PEJMS: Connector; Manufacturer_Name: Hirose; Datasheet Link: https://www.hirose.com/product/en/download_file/key_name/DM3/category/Catalog/doc_file_id/49662/?file_category_id=4&item_id=195&is_series=1; Height: 1.83mm; Manufacturer_Part_Number: DM3CS-SF-PEJMS
U5 = S25FL064LABMFI013: Integrated Circuit; Manufacturer_Name: Cypress Semiconductor; Datasheet Link: http://www.cypress.com/file/316661/download; Height: 2.16mm; Manufacturer_Part_Number: S25FL064LABMFI013; Arrow Part Number: S25FL064LABMFI013; Arrow Price/Stock: https://www.arrow.com/en/products/s25fl064labmfi013/cypress-semiconductor; Mouser Part Number: 727-S25FL064LAMFI013; Mouser Price/Stock: https://www.mouser.co.uk/ProductDetail/Cypress-Semiconductor/S25FL064LABMFI013?qs=u4fy%2FsgLU9PtvO%252BABYRiUQ%3D%3D

## Sheet LCD.SchDoc
size B
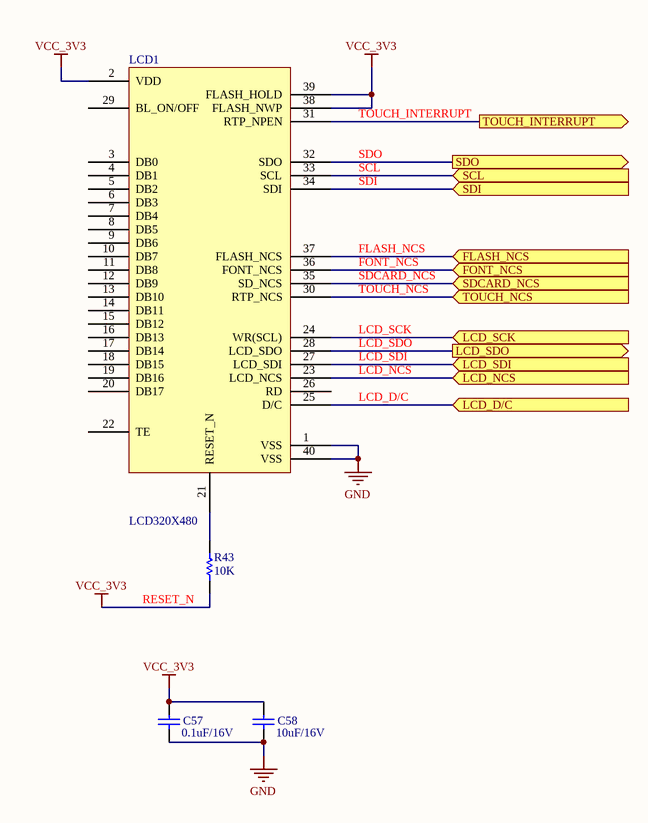
[diagram p11: LCD.SchDoc]

### Parts
C57  0.1uF/16V  [RAD-0.3]
C58  10uF/16V  [RAD-0.3]
LCD1  LCD320X480
R43  10K  [AXIAL-0.3]

### Ports
FLASH_NCS (in), FONT_NCS (in), LCD_D/C (in), LCD_NCS (in), LCD_SCK (in), LCD_SDI (in), LCD_SDO (out), SCL (in), SDCARD_NCS (in), SDI (in), SDO (out), TOUCH_INTERRUPT (out), TOUCH_NCS (in)

### Nets
GND: C57.1 C58.1 LCD1.1(VSS) LCD1.40(VSS)  [project net CMD_EN]
RESET_N: C57.2 C58.2 LCD1.2(VDD) LCD1.38(FLASH_NWP) LCD1.39(FLASH_HOLD) R43.1  [also labelled VCC_3V3]
FLASH_NCS: LCD1.37(FLASH_NCS) ; port FLASH_NCS
FONT_NCS: LCD1.36(FONT_NCS) ; port FONT_NCS
LCD_D/C: LCD1.25(D/C) ; port LCD_D/C
LCD_NCS: LCD1.23(LCD_NCS) ; port LCD_NCS
LCD_SCK: LCD1.24(WR(SCL)) ; port LCD_SCK
LCD_SDI: LCD1.27(LCD_SDI) ; port LCD_SDI
LCD_SDO: LCD1.28(LCD_SDO) ; port LCD_SDO
SCL: LCD1.33(SCL) ; port SCL  [project net FLASH_SCK]
SDCARD_NCS: LCD1.35(SD_NCS) ; port SDCARD_NCS  [project net LCD_SDCARD_CS]
SDI: LCD1.34(SDI) ; port SDI  [project net FLASH_MOSI]
SDO: LCD1.32(SDO) ; port SDO  [project net FLASH_MISO]
TOUCH_INTERRUPT: LCD1.31(RTP_NPEN) ; port TOUCH_INTERRUPT  [project net LCD_TOUCH_INTR]
TOUCH_NCS: LCD1.30(RTP_NCS) ; port TOUCH_NCS  [project net LCD_TOUCH_CS]
NetLCD1_21: LCD1.21(RESET_N) R43.2

Not connected (* = marked no-connect by the designer): LCD1 3(DB0) 4(DB1) 5(DB2) 6(DB3) 7(DB4) 8(DB5) 9(DB6) 10(DB7) 11(DB8) 12(DB9) 13(DB10) 14(DB11) 15(DB12) 16(DB13) 17(DB14) 18(DB15) 19(DB16) 20(DB17) 22(TE) 26(RD) 29(BL_ON/OFF)

### Library data of the parts
C57 C58 = Cap: Capacitor; Published: 8-Jun-2000; LatestRevisionDate: 17-Jul-2002; LatestRevisionNote: Re-released for DXP Platform.; PackageReference: RAD-0.3; Publisher: Altium Limited; PackageDescription: Radial Cap, Thru-Hole; 2 Leads; 0.3 in Pin Spacing
  C57: Value: 0.1uF/16V
  C58: Value: 10uF/16V
LCD1 = ER-TFTM035-6
R43 = Res1: Resistor; Published: 8-Jun-2000; LatestRevisionDate: 17-Jul-2002; LatestRevisionNote: Re-released for DXP Platform.; PackageReference: AXIAL-0.3; Publisher: Altium Limited; PackageDescription: Axial Device, Thru-Hole; 2 Leads; 0.3 in Pin Spacing; Value: 10K